# EasyEDA Pro project ProDoc_Board3_2025-07-21.epro

# Schematic Schematic1_1

## Sheets
1 POWER: Board Name: Board3; Create Date: 2025-07-19; Page Name: POWER; Project Name: 25电赛; Schematic Name: Schematic1_1; Update Date: 2025-07-19; Company: 嘉立创EDA; Page Size: A4; Version: V1.0
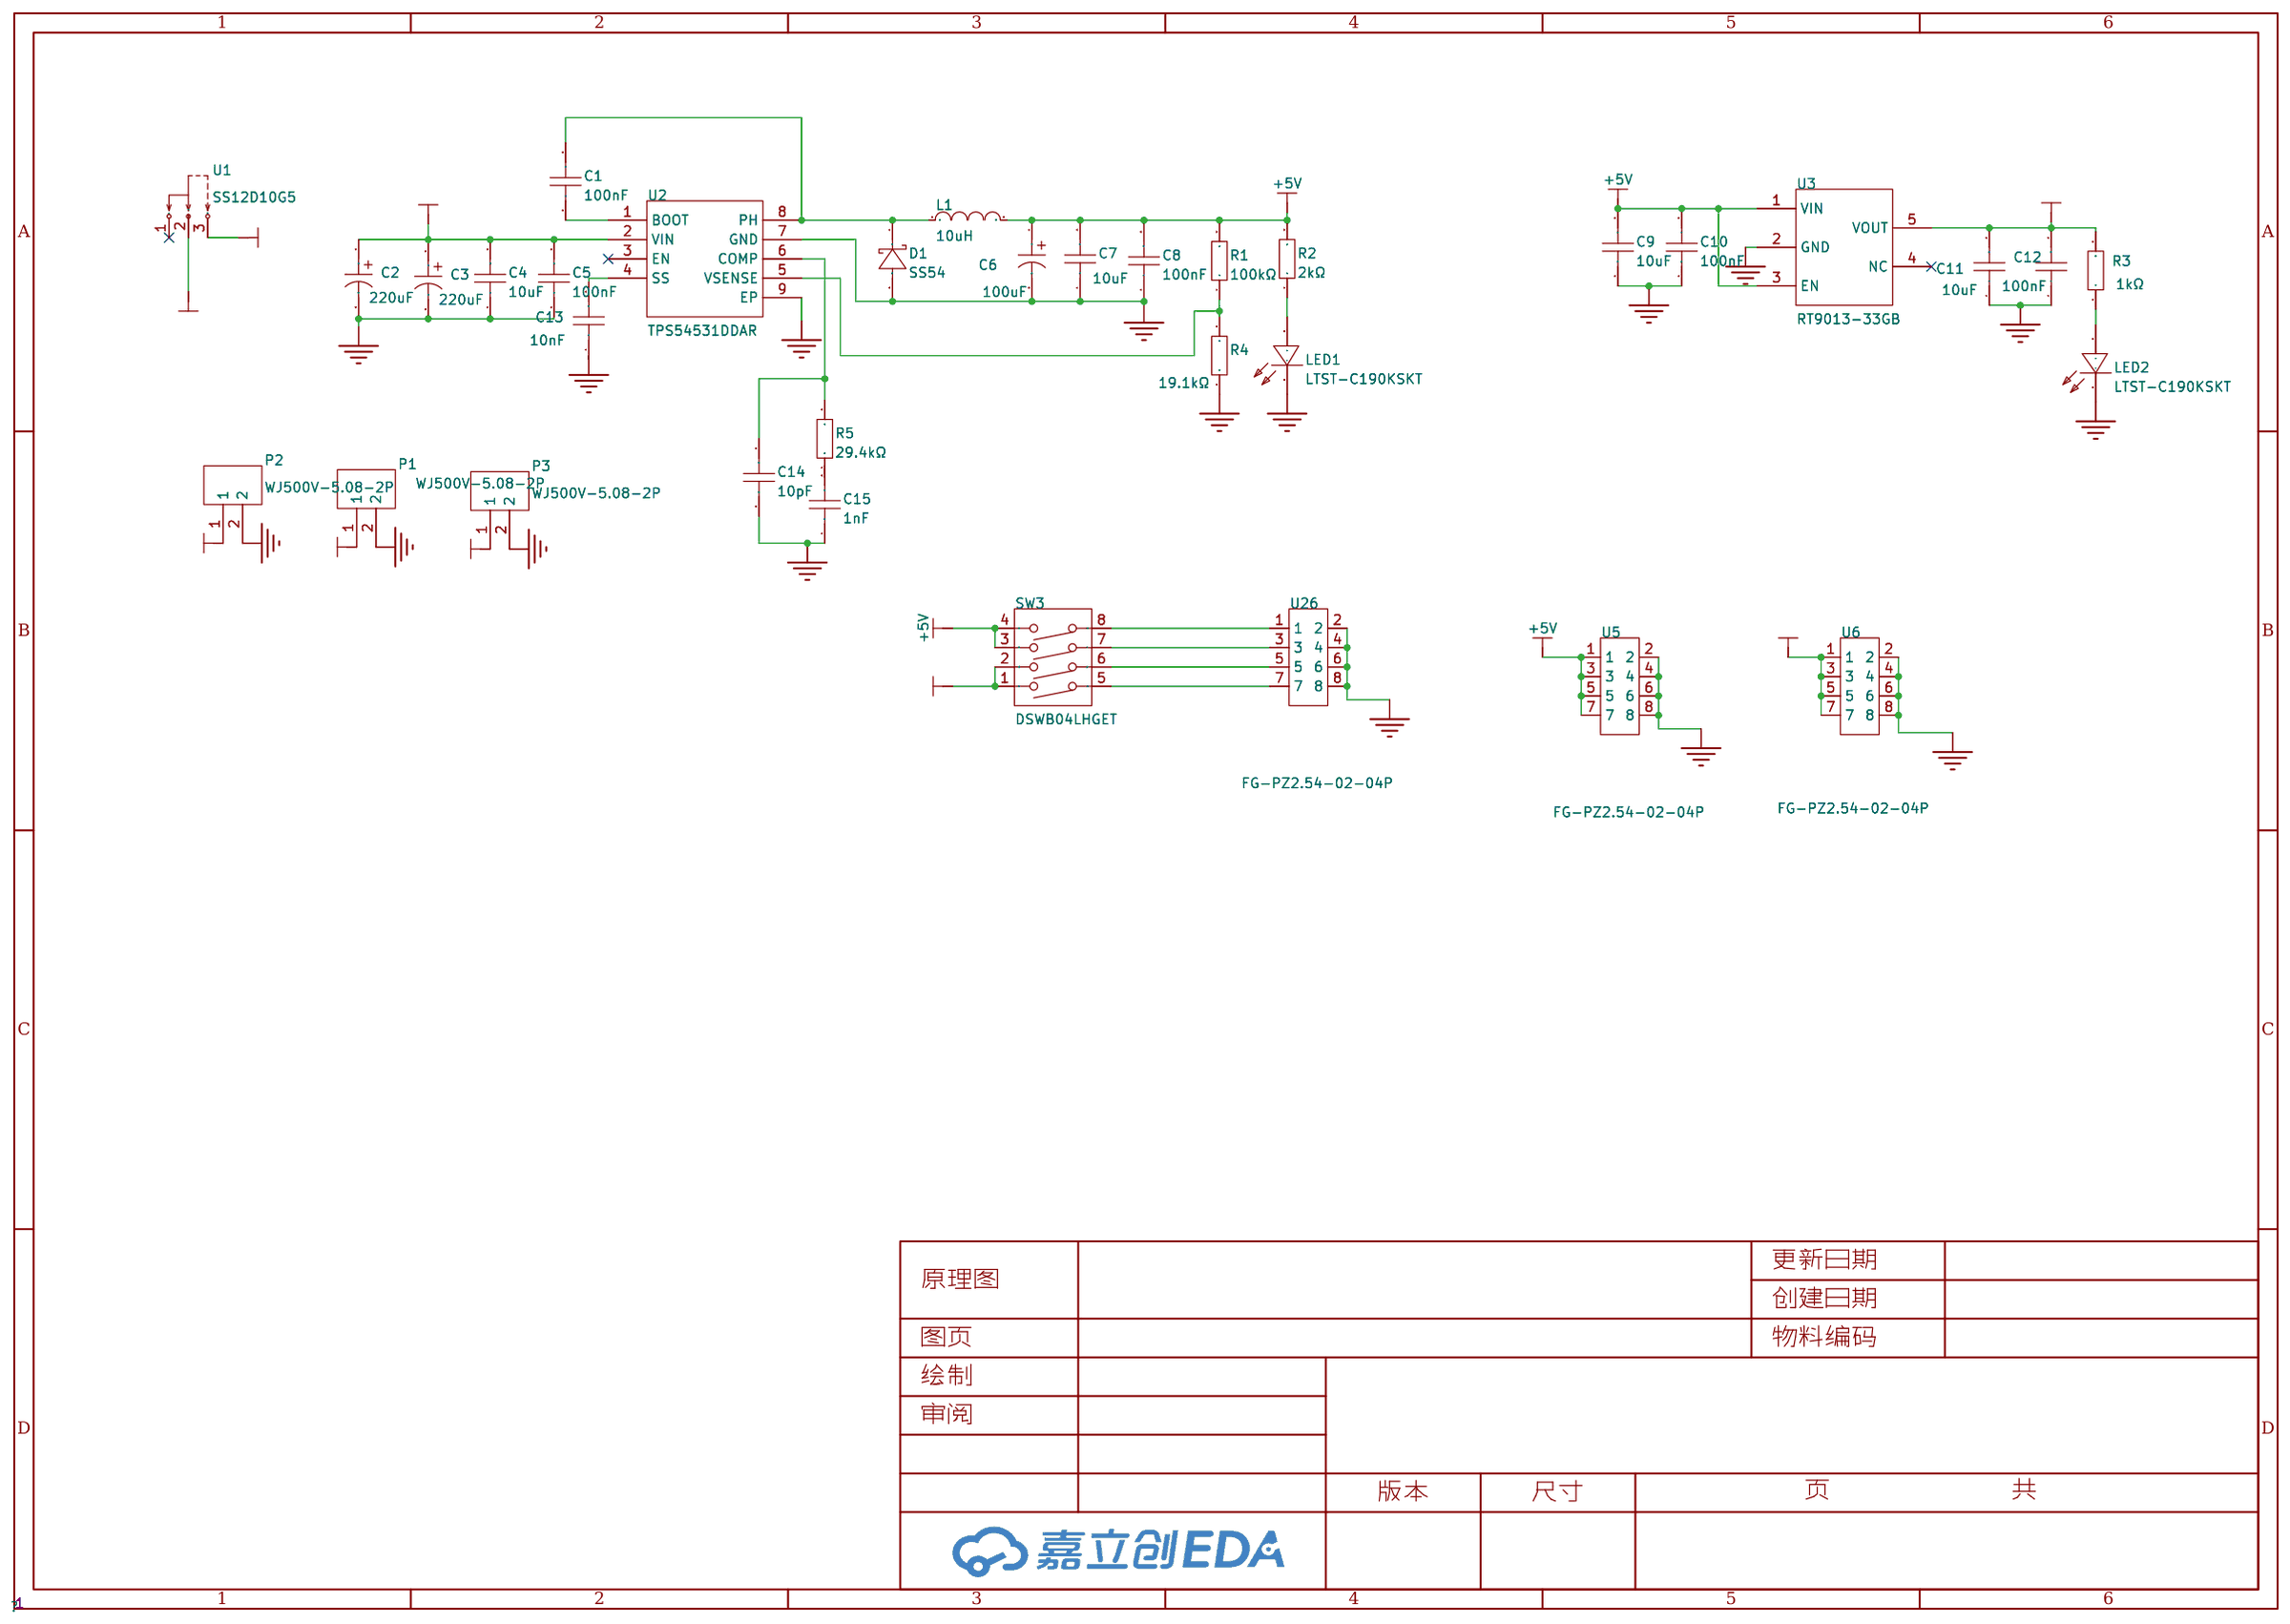
[diagram p0: POWER]
2 器件: Page Name: 器件; Update Date: 2025-07-20
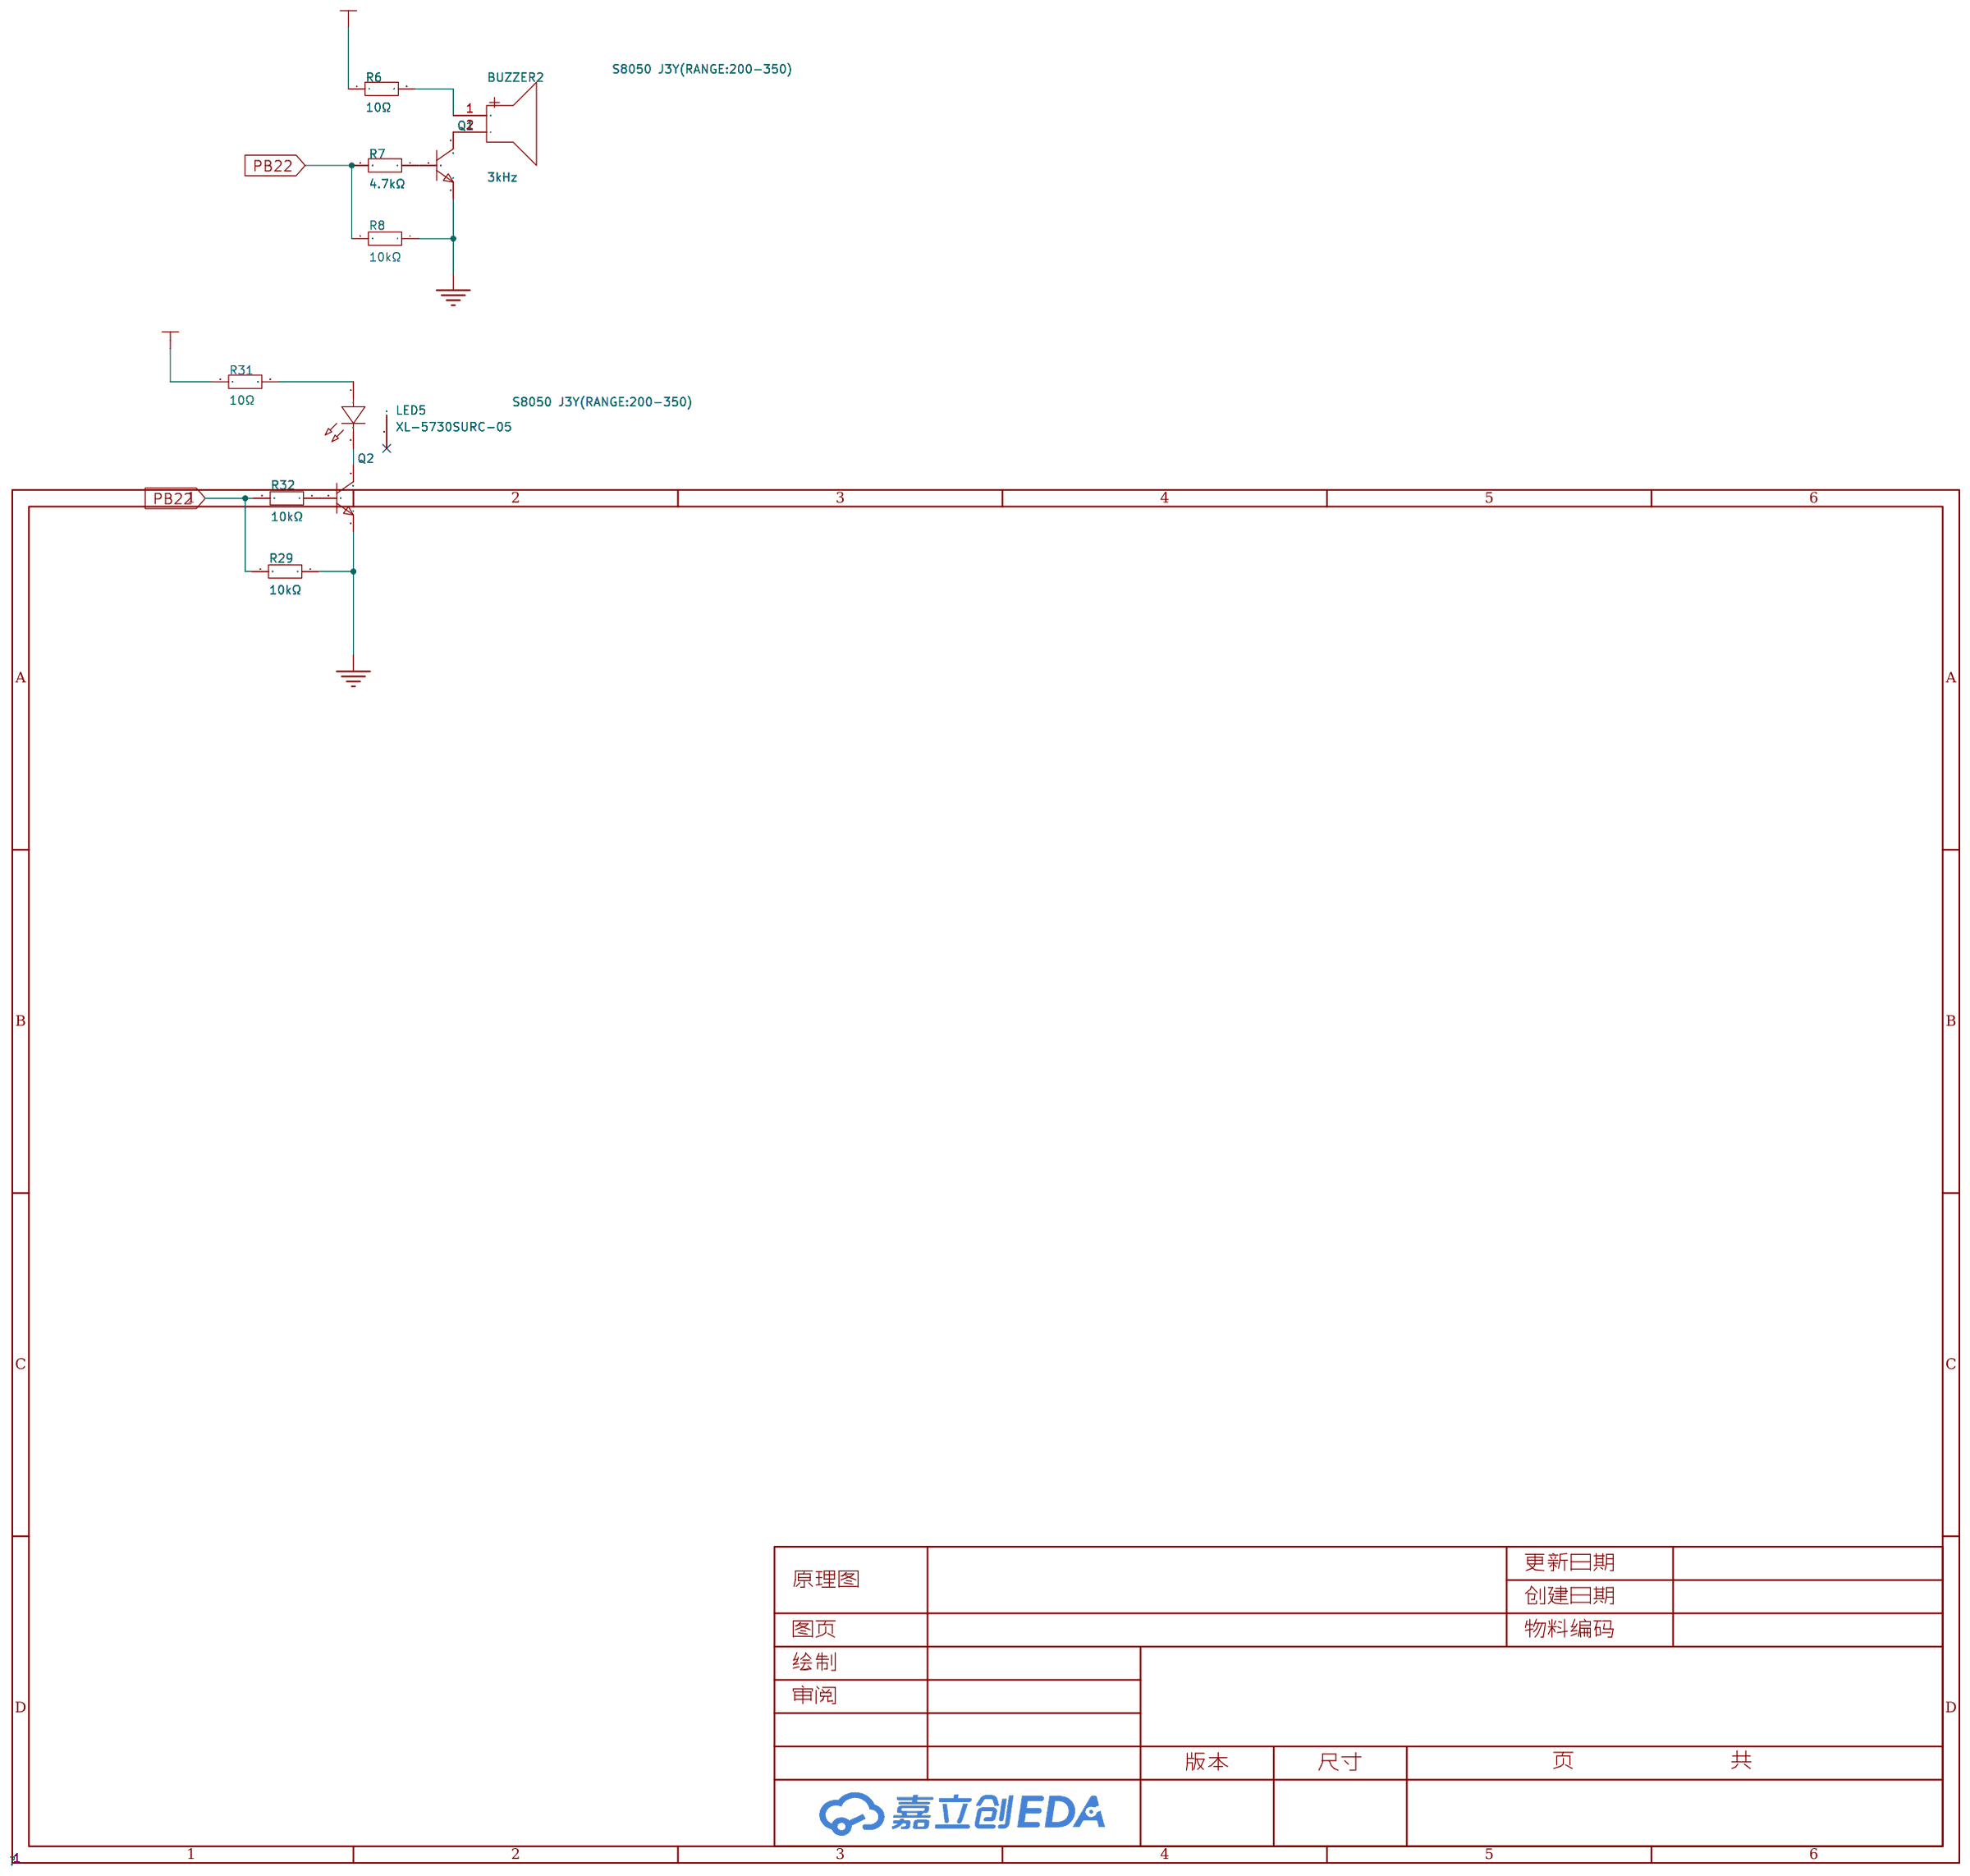
[diagram p1: 器件]
3 连接: Page Name: 连接
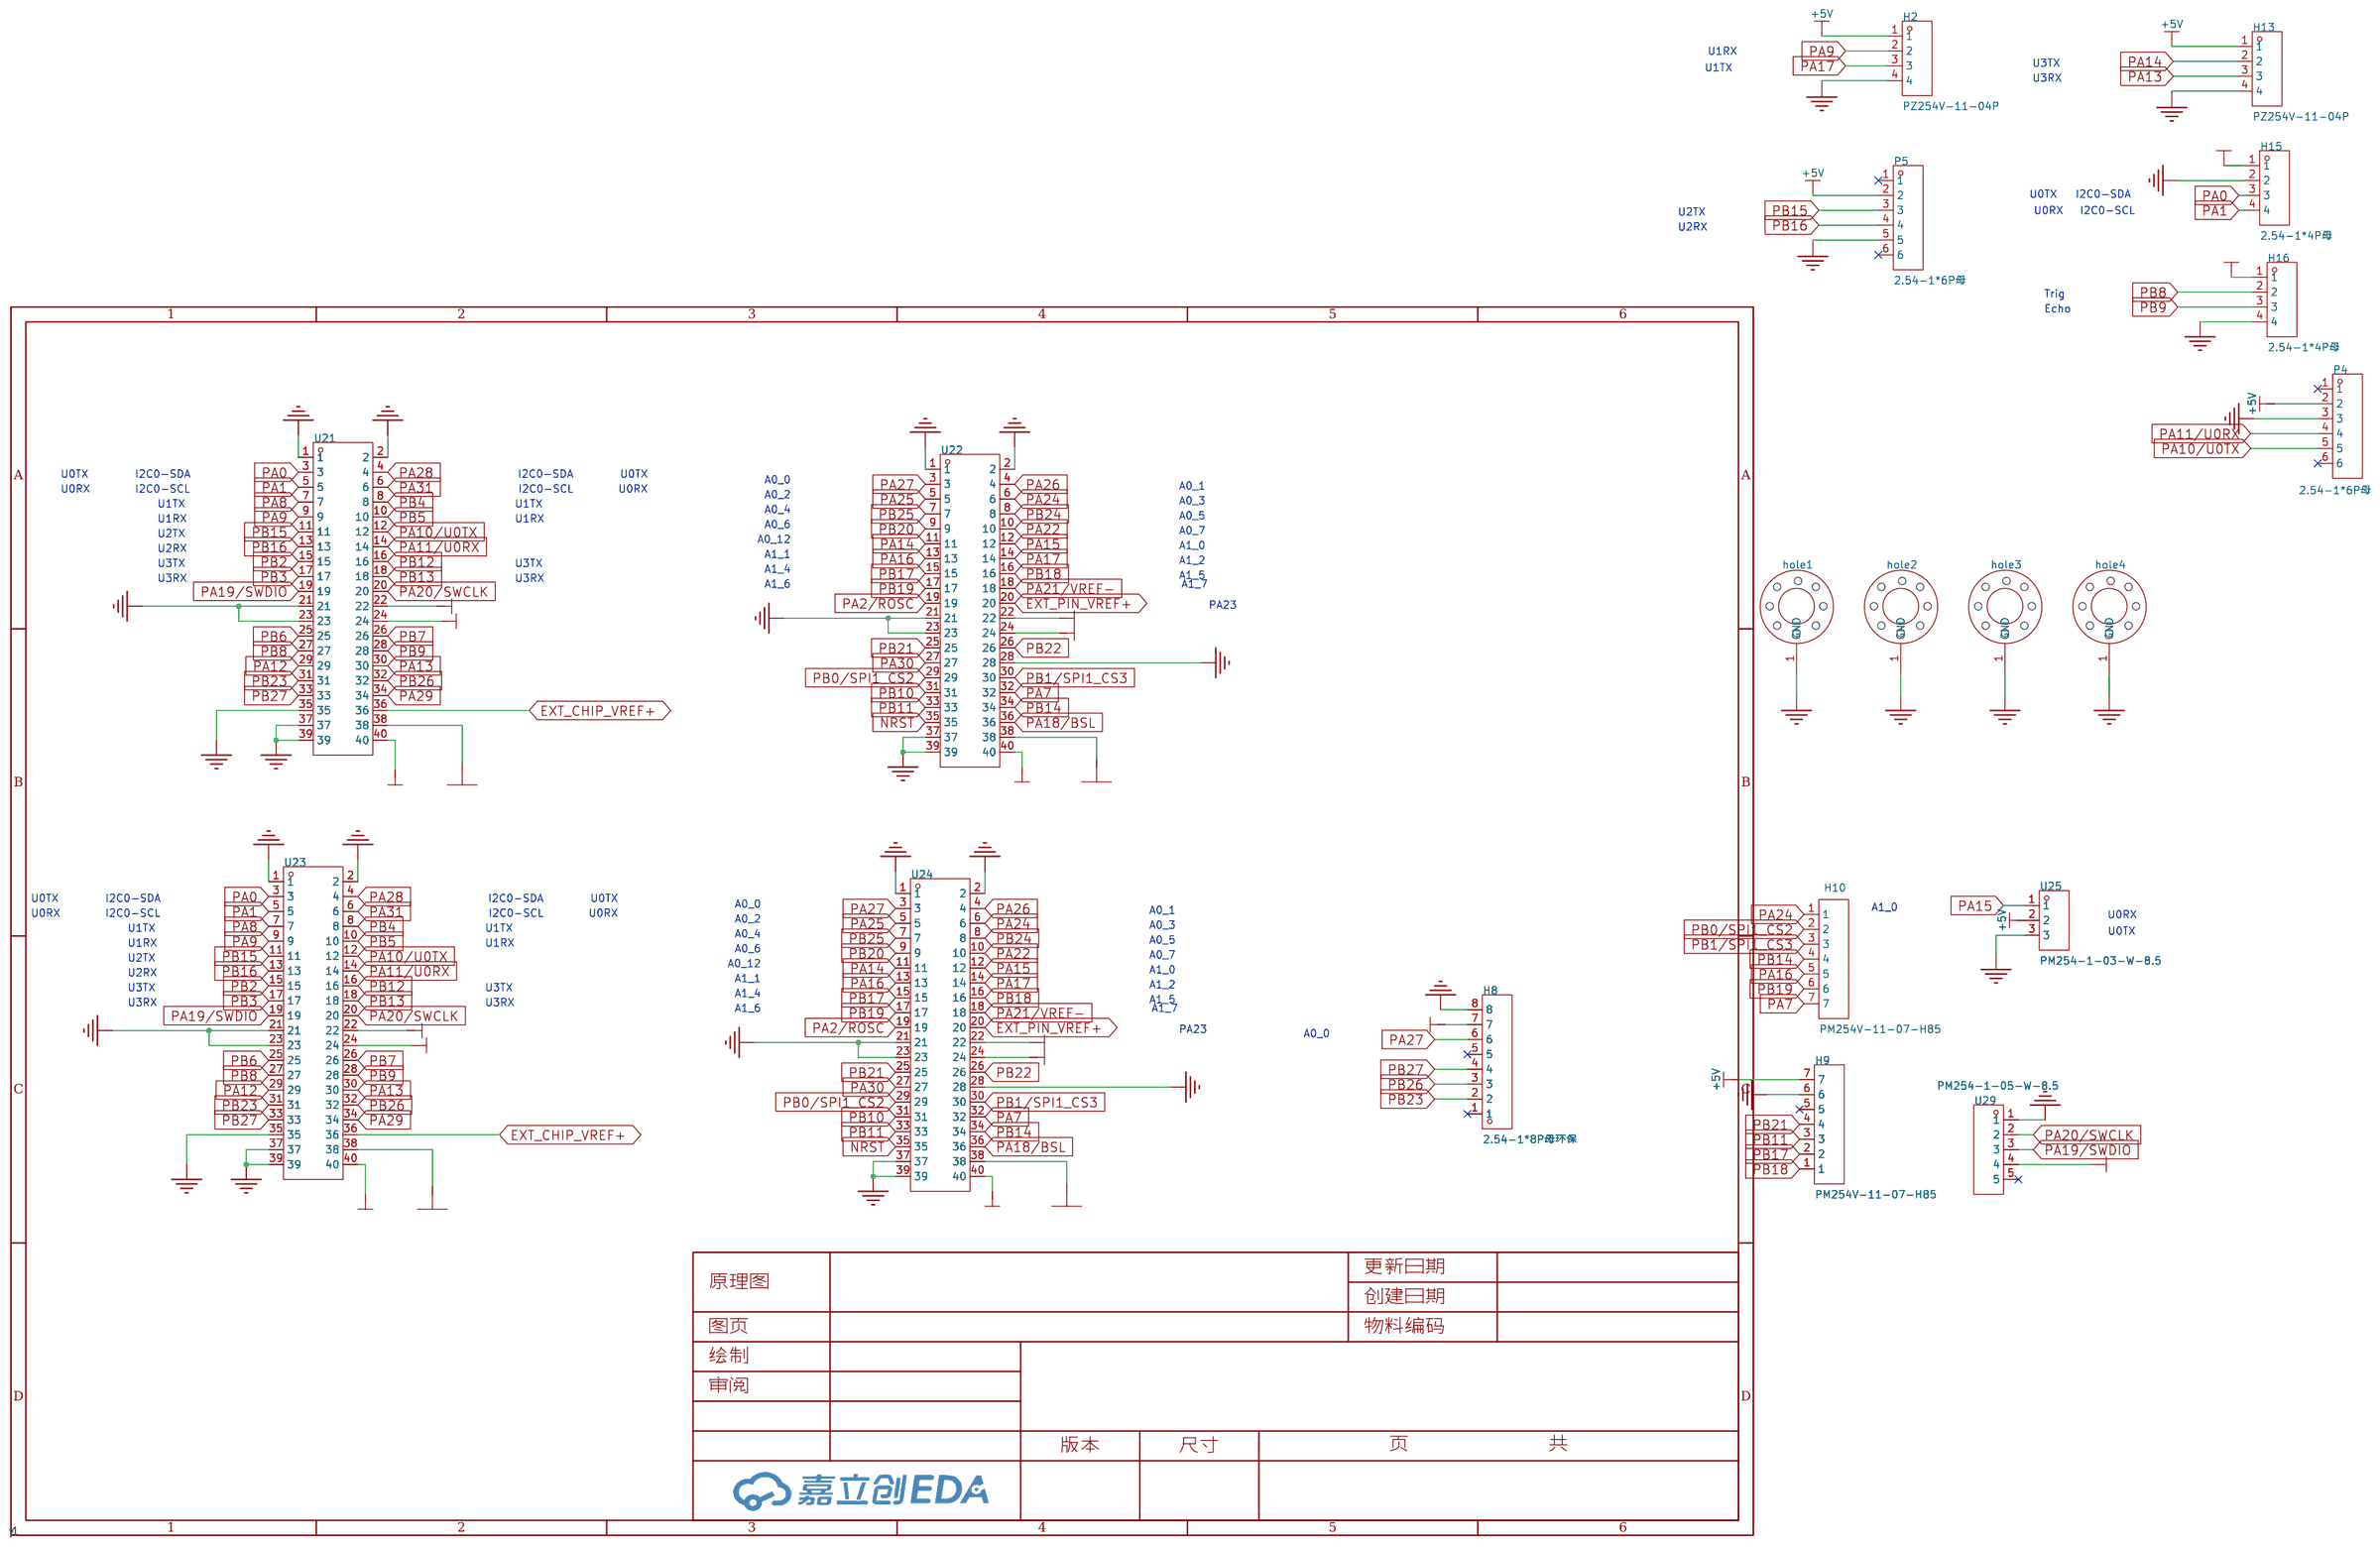
[diagram p2: 连接]

## Parts
sheet POWER
C1  100nF  [C0603]
C2  220uF  [CAP-SMD_BD6.3-L6.6-W6.6-LS7.4-FD]
C3  220uF  [CAP-SMD_BD6.3-L6.6-W6.6-LS7.4-FD]
C4  10uF  [C0805]
C5  100nF  [C0603]
C6  100uF  [CAP-SMD_BD6.3-L6.6-W6.6-LS7.6-RD]
C7  10uF  [C0805]
C8  100nF  [C0603]
C9  10uF  [C0805]
C10  100nF  [C0603]
C11  10uF  [C0805]
C12  100nF  [C0603]
C13  10nF  [C0603]
C14  10pF  [C0603]
C15  1nF  [C0603]
D1  SS54  [SMA_L4.3-W2.6-LS5.0-RD]
L1  10uH  [IND-SMD_L7.3-W6.6]
LED1  LTST-C190KSKT  [LED0603-RD]
LED2  LTST-C190KSKT  [LED0603-RD]
P1  WJ500V-5.08-2P  [CONN-TH_2P-P5.00_WJ500V-5.08-2P]
P2  WJ500V-5.08-2P  [CONN-TH_2P-P5.00_WJ500V-5.08-2P]
P3  WJ500V-5.08-2P  [CONN-TH_2P-P5.00_WJ500V-5.08-2P]
R1  100kΩ  [R0603]
R2  2kΩ  [R0603]
R3  1kΩ  [R0603]
R4  19.1kΩ  [R0603]
R5  29.4kΩ  [R0603]
SW3  DSWB04LHGET  [SW-TH_DSWB04LHGET]
U1  SS12D10G5  [SW-TH_SHOU-HAN_SS12D10G4]
U2  TPS54531DDAR  [SOIC-8_L5.0-W4.0-P1.27-LS6.0-BL-EP2.0]
U3  RT9013-33GB  [SOT-23-5_L3.0-W1.7-P0.95-LS2.8-BL]
U5  FG-PZ2.54-02-04P  [HDR-TH_8P-P2.54-V-M-R2-C4-S2.54]
U6  FG-PZ2.54-02-04P  [HDR-TH_8P-P2.54-V-M-R2-C4-S2.54]
U26  FG-PZ2.54-02-04P  [HDR-TH_8P-P2.54-V-M-R2-C4-S2.54]
sheet 器件
BUZZER2  3kHz  [BUZ-TH_BD9.0-P5.00-D0.6-FD]
LED5  XL-5730SURC-05  [LED-SMD_XL-5730SURC-05]
Q1  S8050 J3Y(RANGE:200-350)  [SOT-23-3_L3.0-W1.7-P0.95-LS2.9-BR]
Q2  S8050 J3Y(RANGE:200-350)  [SOT-23-3_L3.0-W1.7-P0.95-LS2.9-BR]
R6  10Ω  [R0603]
R7  4.7kΩ  [R0603]
R8  10kΩ  [R0603]
R29  10kΩ  [R0603]
R31  10Ω  [R0603]
R32  10kΩ  [R0603]
sheet 连接
H2  PZ254V-11-04P  [HDR-TH_4P-P2.54-V-M]
H8  2.54-1*8P母环保  [HDR-TH_8P-P2.54-V-F-1]
H9  PM254V-11-07-H85  [HDR-TH_7P-P2.54-V-F]
H10  PM254V-11-07-H85  [HDR-TH_7P-P2.54-V-F]
H13  PZ254V-11-04P  [HDR-TH_4P-P2.54-V-M]
H15  2.54-1*4P母  [HDR-TH_4P-P2.54-V-F]
H16  2.54-1*4P母  [HDR-TH_4P-P2.54-V-F]
hole1  M3  [m3 125x300]
hole2  M3  [m3 125x300]
hole3  M3  [m3 125x300]
hole4  M3  [m3 125x300]
P4  2.54-1*6P母  [HDR-TH_6P-P2.54-V-F]
P5  2.54-1*6P母  [HDR-TH_6P-P2.54-V-F]
U21  2.54-2*20  [HDR-TH_40P-P2.54-V-F-R2-C20-S2.54]
U22  2.54-2*20  [HDR-TH_40P-P2.54-V-F-R2-C20-S2.54]
U23  PZ2.54-2*20  [HDR-TH_40P-P2.54-V-M-R2-C20-S2.54]
U24  PZ2.54-2*20  [HDR-TH_40P-P2.54-V-M-R2-C20-S2.54]
U25  PM254-1-03-W-8.5  [HDR-TH_3P-P2.54-H-F-W10.0-N]
U29  PM254-1-05-W-8.5  [HDR-TH_5P-P2.54-H-F-W10.0-N]

## Library data of the parts
C1 C5 C8 C10 C12 = CC0603KRX7R9BB104: 容值:100nF;精度:±10%;额定电压:50V;温度系数:X7R;; LCSC Part Name: 100nF ±10% 50V; Supplier Part: C14663; Manufacturer: YAGEO(国巨); Supplier Footprint: 0603; JLCPCB Part Class: Basic Part; Datasheet: https://atta.szlcsc.com/upload/public/pdf/source/20180910/C282072_33301C7F631E79921B82A8DAC6BCC5B3.pdf; Supplier: LCSC; Tolerance: ±10%; Voltage Rating: 50V; Temperature Coefficient: X7R; Check: true
C2 C3 = RVT1E221M0607: 容值:220uF;精度:±20%;额定电压:25V;纹波电流:150mA@120Hz;等效串联电阻(ESR):-;; LCSC Part Name: 220uF ±20% 25V; Supplier Part: C2918361; Manufacturer: ROQANG(容强); Supplier Footprint: SMD,D6.3xL7.7mm; JLCPCB Part Class: 扩展库; Datasheet: https://atta.szlcsc.com/upload/public/pdf/source/20241024/87413EF5140CF44BEEEC408A2EAB4036.pdf; Supplier: LCSC; Tolerance: ±20%; Voltage Rating: 25V; Ripple Current: 150mA@120Hz; Diameter: 6.3mm; Height - Seated (Max): 7.7mm; Lifetime: 2000hrs@105℃; Operating Temperature: -40℃~+105℃; Check: true
C4 C7 C9 C11 = CL21A106KAYNNNE_C15850: 容值:10uF;精度:±10%;额定电压:25V;材质(温度系数):X5R;; LCSC Part Name: 10uF ±10% 25V; Supplier Part: C15850; Manufacturer: SAMSUNG(三星); Manufacturer Part: CL21A106KAYNNNE; Supplier Footprint: 0805; JLCPCB Part Class: Basic Part; Datasheet: https://atta.szlcsc.com/upload/public/pdf/source/20160218/1457707763339.pdf; Supplier: LCSC; Tolerance: ±10%; Voltage Rated: 25V; Temperature Coefficient: X5R; Check: true
C6 = RVT1H101M0607: 容值:100uF;精度:±20%;额定电压:50V;纹波电流:229mA@120Hz;; LCSC Part Name: 100uF ±20% 50V; Supplier Part: C3151829; Manufacturer: ROQANG(容强); Supplier Footprint: SMD,D6.3xL7.7mm; JLCPCB Part Class: Extended Part; Datasheet: https://atta.szlcsc.com/upload/public/pdf/source/20170325/1490427950282.pdf; Supplier: LCSC; Tolerance: ±20%; Voltage Rating: 50V; Ripple Current: 229mA@120Hz; Diameter: 6.3mm; Height - Seated (Max): 7.7mm; Lifetime: 2000hrs@105℃; Operating Temperature: -40℃~+105℃
C13 = 0603B103K500NT: 容值:10nF;精度:±10%;额定电压:50V;温度系数:X7R;; LCSC Part Name: 10nF ±10% 50V; Supplier Part: C57112; Manufacturer: FH(风华); Supplier Footprint: 0603; JLCPCB Part Class: Basic Part; Datasheet: https://atta.szlcsc.com/upload/public/pdf/source/20200305/C486355_26A10D38EF8C2A5C37091D0039909270.pdf; Supplier: LCSC; Tolerance: ±10%; Voltage Rating: 50V; Temperature Coefficient: X7R
C14 = CL10C100JB8NNNC: 容值:10pF;精度:±5%;额定电压:50V;材质(温度系数):C0G;; LCSC Part Name: 10pF ±5% 50V; Supplier Part: C1634; Manufacturer: SAMSUNG(三星); Supplier Footprint: 0603; JLCPCB Part Class: Basic Part; Datasheet: https://atta.szlcsc.com/upload/public/pdf/source/20160218/1457707763339.pdf; Supplier: LCSC; Tolerance: ±5%; Voltage Rated: 50V; Temperature Coefficient: C0G
C15 = CL10B102KB8NNNC: 容值:1nF;精度:±10%;额定电压:50V;材质(温度系数):X7R;; LCSC Part Name: 1nF ±10% 50V; Supplier Part: C1588; Manufacturer: SAMSUNG(三星); Supplier Footprint: 0603; JLCPCB Part Class: Basic Part; Datasheet: https://atta.szlcsc.com/upload/public/pdf/source/20160218/1457707763339.pdf; Supplier: LCSC; Tolerance: ±10%; Voltage Rated: 50V; Temperature Coefficient: X7R
D1 = SS54_C727065: 二极管配置:独立式;正向压降(Vf):550mV@5A;直流反向耐压(Vr):40V;整流电流:5A;; LCSC Part Name: 电压:40V 电流:5A; Supplier Part: C727065; Manufacturer: TWGMC(台湾迪嘉); Supplier Footprint: SMA(DO-214AC); JLCPCB Part Class: 扩展库; Datasheet: https://atta.szlcsc.com/upload/public/pdf/source/20200828/C727064_BD0A2B36CBC76CEA4B6710C57718D41F.pdf; Supplier: LCSC; Diode Configuration: 独立式; Forward Voltage (Vf@If): 550mV@5A; Reverse Voltage (Vr): 40V; Rectified Current: 5A; Reverse Leakage Current (Ir): 500uA; Check: true
L1 = SMMS0630-100M: 电感值:10uH;精度:±20%;额定电流:-;饱和电流(Isat):5.5A;类型:一体成型电感;; LCSC Part Name: 10uH ±20% 5.5A; Supplier Part: C128692; Manufacturer: SXN(顺翔诺); Supplier Footprint: SMD,6.6x7.3mm; JLCPCB Part Class: 扩展库; Datasheet: https://atta.szlcsc.com/upload/public/pdf/source/20210810/BBF24330FB2F5029F637830BA9C42C0D.pdf; Supplier: LCSC; Tolerance: ±20%; Saturation Current (Isat): 5.5A; DC Resistance (DCR): 68mΩ; Type: 一体成型电感; Check: true
LED1 LED2 = LTST-C190KSKT: 发光颜色:黄色;正向电压(VF):2.1V;功率:75mW;正向电流:20mA;主波长:584.5nm~597nm;二极管配置:-;透镜颜色:无色透明透镜;色温:-;发光强度:104mcd;发光角度:130°;载带方式:-;工作温度:-30℃~+85℃;; LCSC Part Name: 黄灯; Supplier Part: C125095; Manufacturer: LITEON(光宝); Supplier Footprint: 0603; JLCPCB Part Class: 扩展库; Datasheet: https://atta.szlcsc.com/upload/public/pdf/source/20180129/C125095_15171881843821315881.pdf; Supplier: LCSC; Emitted Color: 黄色; Forward Voltage (VF): 2.1V; Power Dissipation: 75mW; Forward Current: 20mA; Dominant Wavelength: 584.5nm~597nm; Peak Wavelength: 588nm; Lens Color: 无色透明透镜; Luminous Intensity: 104mcd; Viewing Angle: 130°; Operating Temperature: -30℃~+85℃; Check: true
P1-P3 = WJ500V-5.08-2P: 结构:1x2P;间距:5.08mm;颜色:绿色;安装方式:直插;额定电流:18A;额定电压:250V;排数:1;线规 - AWG:14~30;线规 - 平方毫米:2.5;每排PIN数:2;触头材质:-;触头镀层:-;工作温度范围:-40℃~+105℃;焊接温度(最大值):-;; LCSC Part Name: 1x2P 5.08mm 直插 排数:1 每排P数:2; Supplier Part: C8465; Manufacturer: KANGNEX(康奈克斯电气); Supplier Footprint: 插件,P=5.08mm; JLCPCB Part Class: 扩展库; Datasheet: https://atta.szlcsc.com/upload/public/pdf/source/20191225/C8465_02D34CE5B5B4A53DF5891601D97FA9F4.pdf; Supplier: LCSC; Structure: 1x2P; Pitch: 5.08mm; Color: 绿色; Mounting Style: 直插; Current Rating (Max): 18A; Voltage Rating (Max): 250V; Number of Pins: 2P; Number of Rows: 1; Wire Gauge - AWG: 14~30; Wire Gauge - mm2: 2.5; Number of PINs Per Row: 2; Operating Temperature Range: -40℃~+105℃; Screw Specification: M2.5; Check: true
R1 = 0603WAF1003T5E: 电阻类型:厚膜电阻;阻值:100kΩ;精度:±1%;功率:100mW;最大工作电压:75V;温度系数:±100ppm/℃;; LCSC Part Name: 100kΩ ±1% 100mW 厚膜电阻; Supplier Part: C25803; Manufacturer: UNI-ROYAL(厚声); Supplier Footprint: 0603; JLCPCB Part Class: Basic Part; Datasheet: https://atta.szlcsc.com/upload/public/pdf/source/20200306/C422600_1E6D84923E4A46A82E41ADD87F860B5C.pdf; Supplier: LCSC; Type: 厚膜电阻; Tolerance: ±1%; Power(Watts): 100mW; Overload Voltage (Max): 75V; Temperature Coefficient: ±100ppm/℃; Operating Temperature Range: -55℃~+155℃
R2 = 0603WAF2001T5E: 电阻类型:厚膜电阻;阻值:2kΩ;精度:±1%;功率:100mW;最大工作电压:75V;温度系数:±100ppm/℃;; LCSC Part Name: 2kΩ ±1% 100mW 厚膜电阻; Supplier Part: C22975; Manufacturer: UNI-ROYAL(厚声); Supplier Footprint: 0603; JLCPCB Part Class: Basic Part; Datasheet: https://atta.szlcsc.com/upload/public/pdf/source/20200306/C422600_1E6D84923E4A46A82E41ADD87F860B5C.pdf; Supplier: LCSC; Type: 厚膜电阻; Tolerance: ±1%; Power(Watts): 100mW; Overload Voltage (Max): 75V; Temperature Coefficient: ±100ppm/℃; Operating Temperature Range: -55℃~+155℃
R3 = 0603WAF1001T5E: 电阻类型:厚膜电阻;阻值:1kΩ;精度:±1%;功率:100mW;最大工作电压:75V;温度系数:±100ppm/℃;; LCSC Part Name: 1kΩ ±1% 100mW 厚膜电阻; Supplier Part: C21190; Manufacturer: UNI-ROYAL(厚声); Supplier Footprint: 0603; JLCPCB Part Class: Basic Part; Datasheet: https://atta.szlcsc.com/upload/public/pdf/source/20200306/C422600_1E6D84923E4A46A82E41ADD87F860B5C.pdf; Supplier: LCSC; Type: 厚膜电阻; Tolerance: ±1%; Power(Watts): 100mW; Overload Voltage (Max): 75V; Temperature Coefficient: ±100ppm/℃; Operating Temperature Range: -55℃~+155℃
R4 = 0603WAF1912T5E: 电阻类型:厚膜电阻;阻值:19.1kΩ;精度:±1%;功率:100mW;最大工作电压:75V;温度系数:±100ppm/℃;; LCSC Part Name: 19.1kΩ ±1% 100mW 厚膜电阻; Supplier Part: C22897; Manufacturer: UNI-ROYAL(厚声); Supplier Footprint: 0603; JLCPCB Part Class: Extended Part; Datasheet: https://atta.szlcsc.com/upload/public/pdf/source/20200306/C422600_1E6D84923E4A46A82E41ADD87F860B5C.pdf; Supplier: LCSC; Type: 厚膜电阻; Tolerance: ±1%; Power(Watts): 100mW; Overload Voltage (Max): 75V; Temperature Coefficient: ±100ppm/℃; Operating Temperature Range: -55℃~+155℃
R5 = FRC0603F2942TS: 电阻类型:厚膜电阻;阻值:29.4kΩ;精度:±1%;功率:100mW;工作电压:75V;温度系数:±100ppm/℃;; LCSC Part Name: 29.4kΩ ±1% 100mW 厚膜电阻; Supplier Part: C2930086; Manufacturer: FOJAN(富捷); Supplier Footprint: 0603; JLCPCB Part Class: Extended Part; Datasheet: https://atta.szlcsc.com/upload/public/pdf/source/20211221/925EC7D7225764EE0046F22065062C87.pdf; Supplier: LCSC; Type: 厚膜电阻; Tolerance: ±1%; Power(Watts): 100mW; Voltage-Supply(Max): 75V; Temperature Coefficient: ±100ppm/℃; Operating Temperature: -55℃~+155℃
SW3 = DSWB04LHGET: 类型:平拨,凸起式;电路结构:单刀单掷;开关位数:4位;使用寿命:-;颜色:红色;; LCSC Part Name: 间距2.54mm 平拨,凸起式 4位拨码开关; Supplier Part: C99418; Manufacturer: YE; Supplier Footprint: 插件; JLCPCB Part Class: 扩展库; Datasheet: https://atta.szlcsc.com/upload/public/pdf/source/20220830/02827E67A8727938D957A3CE4C86C92D.pdf; Supplier: LCSC; Type: 平拨,凸起式; Circuit: 单刀单掷; Number of Positions: 4位; Lead Pitch: 2.54mm; Color: 红色; Check: true
U1 = SS12D10G5: 电路结构:单刀双掷;安装方式:直插;额定电流(DC):2A;额定电压(DC):125V;机械寿命:3千次;; LCSC Part Name: 两档立式插件 3脚拨动开关 柄长5.0mm; Supplier Part: C7431054; Manufacturer: SHOU HAN(首韩); Supplier Footprint: 插件; JLCPCB Part Class: 扩展库; Datasheet: https://atta.szlcsc.com/upload/public/pdf/source/20231130/7A3DB6A149BF0A1DCFFE64FFC07FE434.pdf; Supplier: LCSC; Circuit: 单刀双掷; Switch Length: 12.7mm; Switch Width: 6.7mm; Mounting Style: 直插; Current Rating (DC): 2A; Voltage Rating (DC): 125V; Mechanical Life: 3千次; Operating Temperature: -25℃~+70℃; Check: true
U2 = TPS54531DDAR: 功能类型:降压型;输出类型:可调;工作电压:3.5V~28V;输出电压:-;输出电流:5A;; LCSC Part Name: 28V输入非同步降压转换器; Supplier Part: C50605; Manufacturer: TI(德州仪器); Supplier Footprint: SOIC-8-EP; JLCPCB Part Class: 扩展库; Datasheet: https://www.ti.com/cn/lit/gpn/tps54531; Supplier: LCSC; Function: 降压型; Output Type: 可调; Input Voltage: 3.5V~28V; Output Current: 5A; Switching Frequency: 570kHz; Operating Temperature: -40℃~+150℃; Synchronous Rectification: 否; Number of Outputs: 1; Topology: 降压式; Switch tube (built-in/external): 内置; Check: true
U3 = RT9013-33GB: 输出类型:固定;最大输入电压:5.5V;输出电压:3.3V;输出电流:500mA;电源纹波抑制比(PSRR):50dB@(10kHz);输出极性:正极;; LCSC Part Name: 输入5.5V 输出3.3V 500mA; Supplier Part: C47773; Manufacturer: RICHTEK(立锜); Supplier Footprint: SOT-23-5; JLCPCB Part Class: 扩展库; Datasheet: https://atta.szlcsc.com/upload/public/pdf/source/20150504/1457707282459.pdf; Supplier: LCSC; Output Type: 固定; Maximum Input Voltage: 5.5V; Output Voltage: 3.3V; Output Current: 500mA; Power Supply Rejection Ratio (PSRR): 50dB@(10kHz); Dropout Voltage: 400mV@(500mA); standby current: 50uA; Feature: 低ESR；防静电保护；热保护(TSD)；过流保护(OCP)；带使能; Operating Temperature: -40℃~+85℃; Output Polarity: 正极; Number of Outputs: 1; Check: true
U5 U6 U26 = FG-PZ2.54-02-04P: 插针结构:2x4P;间距:2.54mm;圆针/方针:方针;排数:双排;; LCSC Part Name: 2x4P 间距:2.54mm 方针; Supplier Part: C25687208; Manufacturer: FG(富港); Supplier Footprint: 插件,P=2.54mm; JLCPCB Part Class: 扩展库; Datasheet: https://atta.szlcsc.com/upload/public/pdf/source/20240704/F8AB094A27FC1A2223B0A3F69FCFEA68.pdf; Supplier: LCSC; Pin Structure: 2x4P; Pitch: 2.54mm; Circluar Pins/Square Pins: 方针; Number of Rows: 双排; Check: true
BUZZER2 = HNB09A03: 驱动方式:有源(内含驱动线路);构造类型:电磁式;频率:3kHz;声压(SPL):85dB;; LCSC Part Name: 电磁式有源一体蜂鸣器HNB09A03; Supplier Part: C96102; Manufacturer: 华能; Supplier Footprint: 插件,D=9mm; JLCPCB Part Class: Extended Part; Datasheet: https://atta.szlcsc.com/upload/public/pdf/source/20241128/61C4C8C3938BB25F7C38FBE94CCE8DCF.pdf; Supplier: LCSC; Driver Circuitry: 有源(内含驱动线路); Technology: 电磁式; Voltage - Supply: 1.5V~4.5V; Current Consumption: 30mA; Sound Pressure Level(SPL): 85dB; Diameter(φD): 9mm; Height: 5.5mm; Operating Temperature: -20℃~+70℃
LED5 = XL-5730SURC-05: 发光颜色:红色;正向电压(VF):2.4V;功率:500mW;正向电流:150mA;主波长:620nm~630nm;透镜颜色:无色透明透镜;色温:-;发光角度:120°;载带方式:正贴;工作温度:-20℃~+80℃;; Supplier Part: C2843883; Manufacturer: XINGLIGHT(成兴光); Supplier Footprint: SMD5730; JLCPCB Part Class: 扩展库; Datasheet: https://atta.szlcsc.com/upload/public/pdf/source/20240218/310FB6094B868C78581956B82D4B60CF.pdf; Supplier: LCSC; Emitted Color: 红色; Forward Voltage (VF): 2.4V; Power Dissipation: 500mW; Forward Current: 150mA; Dominant Wavelength: 620nm~630nm; Peak Wavelength: 625nm; Lens Color: 无色透明透镜; Viewing Angle: 120°; Mounting Sytle: 正贴; Operating Temperature: -20℃~+80℃
Q1 Q2 = S8050 J3Y(RANGE:200-350): 晶体管类型:NPN;集电极电流(Ic):500mA;集射极击穿电压(Vceo):25V;耗散功率(Pd):300mW;直流电流增益(hFE):200@500mA,1V;; LCSC Part Name: H档(200-350); Supplier Part: C2146; Manufacturer: CJ(江苏长电/长晶); Supplier Footprint: SOT-23; JLCPCB Part Class: 基础库; Datasheet: https://atta.szlcsc.com/upload/public/pdf/source/20231013/FF37B6A000E6CDA75C9C999D2E78731F.pdf; Supplier: LCSC; type: NPN; Current - Collector(Ic): 500mA; Collector - Emitter Voltage VCEO: 25V; Pd - Power Dissipation: 300mW; DC Current Gain: 200@500mA,1V; Transition frequency(fT): 150MHz; Current - Collector Cutoff: 100nA; Vce Saturation(VCE(sat)): 600mV; Operating Temperature: -55℃~+150℃; Check: true
R6 R31 = 0603WAF100JT5E: 电阻类型:厚膜电阻;阻值:10Ω;精度:±1%;功率:100mW;最大工作电压:75V;温度系数:±400ppm/℃;; LCSC Part Name: 10Ω ±1% 100mW 厚膜电阻; Supplier Part: C22859; Manufacturer: UNI-ROYAL(厚声); Supplier Footprint: 0603; JLCPCB Part Class: Basic Part; Datasheet: https://atta.szlcsc.com/upload/public/pdf/source/20200306/C422600_1E6D84923E4A46A82E41ADD87F860B5C.pdf; Supplier: LCSC; Type: 厚膜电阻; Tolerance: ±1%; Power(Watts): 100mW; Overload Voltage (Max): 75V; Temperature Coefficient: ±400ppm/℃; Operating Temperature Range: -55℃~+155℃
R7 = 0603WAF4701T5E: 电阻类型:厚膜电阻;阻值:4.7kΩ;精度:±1%;功率:100mW;最大工作电压:75V;温度系数:±100ppm/℃;; LCSC Part Name: 4.7kΩ ±1% 100mW 厚膜电阻; Supplier Part: C23162; Manufacturer: UNI-ROYAL(厚声); Supplier Footprint: 0603; JLCPCB Part Class: 基础库; Datasheet: https://atta.szlcsc.com/upload/public/pdf/source/20200306/C422600_1E6D84923E4A46A82E41ADD87F860B5C.pdf; Supplier: LCSC; Type: 厚膜电阻; Tolerance: ±1%; Power(Watts): 100mW; Overload Voltage (Max): 75V; Temperature Coefficient: ±100ppm/℃; Operating Temperature Range: -55℃~+155℃; Check: true
R8 R29 R32 = 0603WAF1002T5E: 电阻类型:厚膜电阻;阻值:10kΩ;精度:±1%;功率:100mW;工作电压:75V;温度系数:±100ppm/℃;; LCSC Part Name: 厚膜电阻 10kΩ ±1% 100mW; Supplier Part: C25804; Manufacturer: UNI-ROYAL(厚声); Supplier Footprint: 0603; JLCPCB Part Class: Basic Part; Datasheet: https://atta.szlcsc.com/upload/public/pdf/source/20200306/C422600_1E6D84923E4A46A82E41ADD87F860B5C.pdf; Supplier: LCSC; Type: 厚膜电阻; Tolerance: ±1%; Power(Watts): 100mW; Overload Voltage (Max): 75V; Temperature Coefficient: ±100ppm/℃; Operating Temperature Range: -55℃~+155℃; Voltage-Supply(Max): 75V; Operating Temperature: -55℃~+155℃
H2 H13 = PZ254V-11-04P: 插针结构:1x4P;间距:2.54mm;行距:-;圆针/方针:方针;安装类型:直插;排数:单排;总PIN位数:4P;额定电流:3A;额定电压:250V;配合针长度:6mm;塑高:2.5mm;端接针长度:3mm;触头材质:-;工作温度范围:-40℃~+105℃;颜色:黑色;; LCSC Part Name: 间距:2.54mm 1x4P 直插 方针; Supplier Part: C2691448; Manufacturer: XFCN(兴飞); Supplier Footprint: 插件,P=2.54mm; JLCPCB Part Class: 扩展库; Datasheet: https://atta.szlcsc.com/upload/public/pdf/source/20200309/C492403_F9F19131791D08044AD4F84F8E751A34.pdf; Supplier: LCSC; Pin Structure: 1x4P; Pitch: 2.54mm; Circluar Pins/Square Pins: 方针; Mounting Type: 直插; Number of Rows: 单排; Number of Pins: 4P; Current Rating (Max): 3A; Voltage Rating (Max): 250V; Length of Mating Pin: 6mm; Insulation Height: 2.5mm; Length of End Connection Pin: 3mm; Operating Temperature Range: -40℃~+105℃; Color: 黑色; Check: true
H8 = 2.54-1*8P母环保: 插孔结构:1x8P;间距:2.54mm;行距:-;安装类型:直插;排数:单排;总孔位数:8P;塑高:-;触头材质:-;触头镀层:-;; LCSC Part Name: 间距:2.54mm 1x8P 直插; Supplier Part: C27438; Manufacturer: BOOMELE(博穆精密); Supplier Footprint: 插件,P=2.54mm; JLCPCB Part Class: Extended Part; Datasheet: https://atta.szlcsc.com/upload/public/pdf/source/20231221/1CA800C6799ED97958773716FAA1BFFE.pdf; Supplier: LCSC; Holes Structure: 1x8P; Pitch: 2.54mm; Mounting Type: 直插; Number of Rows: 单排; Number of Holes: 8P
H9 H10 = PM254V-11-07-H85: 插孔结构:1x7P;间距:2.54mm;行距:-;圆孔/方孔:方孔;安装类型:直插;排数:单排;总孔位数:7P;额定电流:3A;额定电压:250V;插孔方向:顶部;塑高:-;工作温度范围:-40℃~+105℃;; LCSC Part Name: 间距:2.54mm 1x7P 直插; Supplier Part: C2832270; Manufacturer: XFCN(兴飞); Supplier Footprint: 插件,P=2.54mm; JLCPCB Part Class: Extended Part; Datasheet: https://atta.szlcsc.com/upload/public/pdf/source/20210514/C2832270_F424CC0071A81298BFB56B53406F9842.pdf; Supplier: LCSC; Holes Structure: 1x7P; Pitch: 2.54mm; Circular Hole / Square Hole: 方孔; Mounting Type: 直插; Number of Rows: 单排; Number of Holes: 7P; Current Rating (Max): 3A; Voltage Rating (Max): 250V; Holes Direction: 顶部; Operating Temperature Range: -40℃~+105℃
H15 H16 = 2.54-1*4P母: 插孔结构:1x4P;间距:2.54mm;行距:-;圆孔/方孔:方孔;安装类型:直插;排数:单排;总孔位数:4P;额定电流:3A;额定电压:-;插孔方向:顶部;塑高:-;触头材质:青铜;触头镀层:-;工作温度范围:-40℃~+105℃;焊接温度(最大值):-;; LCSC Part Name: 间距:2.54mm 1x4P 直插; Supplier Part: C2718488; Manufacturer: BOOMELE(博穆精密); Supplier Footprint: 插件,P=2.54mm; JLCPCB Part Class: 扩展库; Datasheet: https://atta.szlcsc.com/upload/public/pdf/source/20210301/C2718488_F4427B881E42CAA8DDB0B1C12B3A522C.pdf; Supplier: LCSC; Holes Structure: 1x4P; Pitch: 2.54mm; Circular Hole / Square Hole: 方孔; Mounting Type: 直插; Number of Rows: 单排; Number of Holes: 4P; Current Rating (Max): 3A; Holes Direction: 顶部; Contact Material: 青铜; Operating Temperature Range: -40℃~+105℃
hole1-hole4 = m3_梅花螺丝孔: 梅花螺丝孔; Check: false
P4 P5 = 2.54-1*6P母: 插孔结构:1x6P;间距:2.54mm;行距:-;安装类型:直插;排数:单排;总孔位数:6P;塑高:-;触头材质:-;触头镀层:-;; LCSC Part Name: 间距:2.54mm 1x6P 直插; Supplier Part: C40877; Manufacturer: BOOMELE(博穆精密); Supplier Footprint: 插件,P=2.54mm; JLCPCB Part Class: 扩展库; Datasheet: https://atta.szlcsc.com/upload/public/pdf/source/20210301/C2718488_F4427B881E42CAA8DDB0B1C12B3A522C.pdf; Supplier: LCSC; Holes Structure: 1x6P; Pitch: 2.54mm; Mounting Type: 直插; Number of Rows: 单排; Number of Holes: 6P
U21 U22 = 2.54-2*20: 插孔结构:2x20P;间距:2.54mm;行距:2.54mm;圆孔/方孔:方孔;安装类型:直插;排数:双排;总孔位数:40P;额定电流:2.5A;额定电压:-;插孔方向:顶部;塑高:8.5mm;工作温度范围:-40℃~+105℃;; LCSC Part Name: 间距:2.54mm 2x20P 直插; Supplier Part: C2977589; Manufacturer: ZHOURI(洲日); Supplier Footprint: 插件,P=2.54mm; JLCPCB Part Class: Extended Part; Datasheet: https://atta.szlcsc.com/upload/public/pdf/source/20220328/834E302BE3C038BBC5C70F5E02589B1E.pdf; Supplier: LCSC; Holes Structure: 2x20P; Pitch: 2.54mm; Row Spacing: 2.54mm; Circular Hole / Square Hole: 方孔; Mounting Type: 直插; Number of Rows: 双排; Number of Holes: 40P; Current Rating (Max): 2.5A; Holes Direction: 顶部; Insulation Height: 8.5mm; Operating Temperature Range: -40℃~+105℃
U23 U24 = PZ2.54-2*20: 插针结构:2x20P;间距:2.54mm;安装类型:直插;排数:双排;总PIN位数:40P;触头镀层:金;; Supplier Part: C5224014; Manufacturer: ZHOURI(洲日); Supplier Footprint: 插件,P=2.54mm; JLCPCB Part Class: 扩展库; Datasheet: https://atta.szlcsc.com/upload/public/pdf/source/20221102/7E8316C38DB6D81BB18273F4CFF8B2F6.pdf; Supplier: LCSC; Pin Structure: 2x20P; Pitch: 2.54mm; Mounting Type: 直插; Number of Rows: 双排; Number of Pins: 40P; Contact Plating: 金; Check: true
U25 = PM254-1-03-W-8.5: 插孔结构:1x3P;间距:2.54mm;行距:-;圆孔/方孔:方孔;安装类型:弯插;排数:单排;总孔位数:3P;额定电流:3A;额定电压:-;插孔方向:侧面;塑高:8.5mm;触头材质:铜合金;工作温度范围:-40℃~+105℃;焊接温度(最大值):260℃@5S;; LCSC Part Name: 1x3P 间距:2.54mm 弯插; Supplier Part: C2897385; Manufacturer: HCTL(华灿天禄); Supplier Footprint: 弯插,P=2.54mm; JLCPCB Part Class: 扩展库; Datasheet: https://atta.szlcsc.com/upload/public/pdf/source/20230609/7BA40A3D721268A082DCDEAD4C99131B.pdf; Supplier: LCSC; Holes Structure: 1x3P; Pitch: 2.54mm; Circular Hole / Square Hole: 方孔; Mounting Type: 弯插; Number of Rows: 单排; Number of Holes: 3P; Current Rating (Max): 3A; Holes Direction: 侧面; Insulation Height: 8.5mm; Contact Material: 铜合金; Operating Temperature Range: -40℃~+105℃; Soldering Temperature(Max): 260℃@5S; Check: true
U29 = PM254-1-05-W-8.5: 插孔结构:1x5P;间距:2.54mm;行距:-;圆孔/方孔:方孔;安装方式:弯插;排数:单排;总孔位数:5P;额定电流:3A;额定电压:-;插孔方向:侧面;塑高:8.5mm;触头材质:铜合金;工作温度:-40℃~+105℃;; LCSC Part Name: 1x5P 间距:2.54mm 弯插; Supplier Part: C2897387; Manufacturer: HCTL(华灿天禄); Supplier Footprint: 弯插,P=2.54mm; JLCPCB Part Class: 扩展库; Datasheet: https://atta.szlcsc.com/upload/public/pdf/source/20230609/7BA40A3D721268A082DCDEAD4C99131B.pdf; Supplier: LCSC; Holes Structure: 1x5P; Pitch: 2.54mm; Circular Hole / Square Hole: 方孔; Mounting Type: 弯插; Number of Rows: 单排; Number of Positions: 5P; Current Rating: 3A; Holes Direction: 侧面; Insulation Height: 8.5mm; Contact Material: 铜合金; Operating Temperature: -40℃~+105℃

## Nets
3V3: C11.2 C12.2 R3.2 R6.1 R31.1 SW3.1 SW3.2 U3.5(VOUT) U6.1 U6.3 U6.5 U6.7 U21.22 U21.38 U22.22 U22.38 U23.22 U23.38 U24.22 U24.38 U29.4
+5V: C6.1 C7.2 C8.2 C9.2 C10.2 H2.1 H8.7 H9.7 H13.1 H15.1 H16.1 L1.2 P4.2 P5.2 R1.2 R2.2 SW3.3 SW3.4 U3.1(VIN) U3.3(EN) U5.1 U5.3 U5.5 U5.7 U21.24 U21.40 U22.24 U22.40 U23.24 U23.40 U24.24 U24.40 U25.2
GND: C2.2 C3.2 C4.1 C5.1 C6.2 C7.1 C8.1 C9.1 C10.1 C11.1 C12.1 C13.1 C14.1 C15.1 D1.2 H2.4 H8.8 H9.6 H13.4 H15.2 H16.4 hole1.1(GND) hole2.1(GND) hole3.1(GND) hole4.1(GND) LED1.1(-) LED2.1(-) P1.2 P2.2 P3.2 P4.3 P5.5 Q1.2(E) Q2.2(E) R4.1 R8.1 R29.1 U2.7(GND) U2.9(EP) U3.2(GND) U5.2 U5.4 U5.6 U5.8 U6.2 U6.4 U6.6 U6.8 U21.1 U21.2 U21.21 U21.23 U21.35 U21.37 U21.39 U22.1 U22.2 U22.21 U22.23 U22.28 U22.37 U22.39 U23.1 U23.2 U23.21 U23.23 U23.35 U23.37 U23.39 U24.1 U24.2 U24.21 U24.23 U24.28 U24.37 U24.39 U25.3 U26.2 U26.4 U26.6 U26.8 U29.1
VBAT: P2.1 U1.2
VIN: C2.1 C3.1 C4.2 C5.2 P1.1 P3.1 U1.3 U2.2(VIN)
EXT_CHIP_VREF+: U21.36 U23.36
EXT_PIN_VREF+: U22.20 U24.20
NRST: U22.35 U24.35
PA0: H15.3 U21.3 U23.3
PA1: H15.4 U21.5 U23.5
PA2/ROSC: U22.19 U24.19
PA7: H10.7 U22.32 U24.32
PA8: U21.7 U23.7
PA9: H2.2 U21.9 U23.9
PA10/U0TX: P4.5 U21.12 U23.12
PA11/U0RX: P4.4 U21.14 U23.14
PA12: U21.29 U23.29
PA13: H13.3 U21.30 U23.30
PA14: H13.2 U22.11 U24.11
PA15: U22.12 U24.12 U25.1
PA16: H10.5 U22.13 U24.13
PA17: H2.3 U22.14 U24.14
PA18/BSL: U22.36 U24.36
PA19/SWDIO: U21.19 U23.19 U29.3
PA20/SWCLK: U21.20 U23.20 U29.2
PA21/VREF-: U22.18 U24.18
PA22: U22.10 U24.10
PA24: H10.1 U22.6 U24.6
PA25: U22.5 U24.5
PA26: U22.4 U24.4
PA27: H8.6 U22.3 U24.3
PA28: U21.4 U23.4
PA29: U21.34 U23.34
PA30: U22.27 U24.27
PA31: U21.6 U23.6
PB0/SPI1_CS2: H10.2 U22.29 U24.29
PB1/SPI1_CS3: H10.3 U22.30 U24.30
PB2: U21.15 U23.15
PB3: U21.17 U23.17
PB4: U21.8 U23.8
PB5: U21.10 U23.10
PB6: U21.25 U23.25
PB7: U21.26 U23.26
PB8: H16.2 U21.27 U23.27
PB9: H16.3 U21.28 U23.28
PB10: U22.31 U24.31
PB11: H9.3 U22.33 U24.33
PB12: U21.16 U23.16
PB13: U21.18 U23.18
PB14: H10.4 U22.34 U24.34
PB15: P5.3 U21.11 U23.11
PB16: P5.4 U21.13 U23.13
PB17: H9.2 U22.15 U24.15
PB18: H9.1 U22.16 U24.16
PB19: H10.6 U22.17 U24.17
PB20: U22.9 U24.9
PB21: H9.4 U22.25 U24.25
PB22: R7.2 R8.2 R29.2 R32.2 U22.26 U24.26
PB23: H8.2 U21.31 U23.31
PB24: U22.8 U24.8
PB25: U22.7 U24.7
PB26: H8.3 U21.32 U23.32
PB27: H8.4 U21.33 U23.33
$1N1042: C1.1 U2.1(BOOT)
$1N1058: C1.2 D1.1 L1.1 U2.8(PH)
$1N1158: C13.2 U2.4(SS)
$1N1897: R1.1 R4.2 U2.5(VSENSE)
$1N2016: C15.2 R5.1
$1N2020: C14.2 R5.2 U2.6(COMP)
$1N2296: LED1.2(+) R2.1
$1N2398: LED2.2(+) R3.1
$1N16322: SW3.5 U26.7
$1N16401: SW3.8 U26.1
$1N17521: SW3.6 U26.5
$1N17525: SW3.7 U26.3
$2N2960: BUZZER2.1(+) R6.2
$2N2963: Q1.1(B) R7.1
$2N8954: BUZZER2.2(-) Q1.3(C)
$2N9572: LED5.2 Q2.3(C)
$2N9593: LED5.1 R31.2
$2N9836: Q2.1(B) R32.1

Not connected (* = marked no-connect by the designer): H8 1* 5*; H9 5*; LED5 3*; P4 1* 6*; P5 1* 6*; U1 1*; U2 3(EN)*; U3 4(NC)*; U29 5*

## Notes on the sheets
sheet 3
- U1RX
- U1TX
- U3RX
- U3TX
- U0TX
- I2C0-SDA
- U2TX
- U0RX
- I2C0-SCL
- U2RX
- Trig
- Echo
- U0TX
- I2C0-SDA
- I2C0-SDA
- U0TX
- A0_0
- U0RX
- I2C0-SCL
- I2C0-SCL
- U0RX
- A0_2
- A0_4
- A0_1
- A0_3
- U1RX
- U1TX
- U1RX
- U1TX
- A0_6
- A0_5
- U2TX
- A0_12
- A0_7
- U2RX
- A1_1
- A1_0
- U3TX
- U3TX
- A1_4
- A1_2
- U3RX
- U3RX
- A1_6
- A1_5
- A1_7
- PA23
- U0TX
- I2C0-SDA
- I2C0-SDA
- U0TX
- A0_0
- U0RX
- I2C0-SCL
- I2C0-SCL
- U0RX
- A0_2
- A0_1
- A1_0
- U0RX
- U1TX
- U1TX
- A0_4
- A0_6
- A0_3
- A0_5
- U0TX
- U1RX
- U2TX
- U1RX
- A0_12
- A0_7
- U2RX
- A1_1
- A1_0
- U3TX
- U3TX
- A1_4
- A1_2
- U3RX
- U3RX
- A1_6
- A1_5
- A1_7
- PA23
- A0_0

# Board PCB1_1
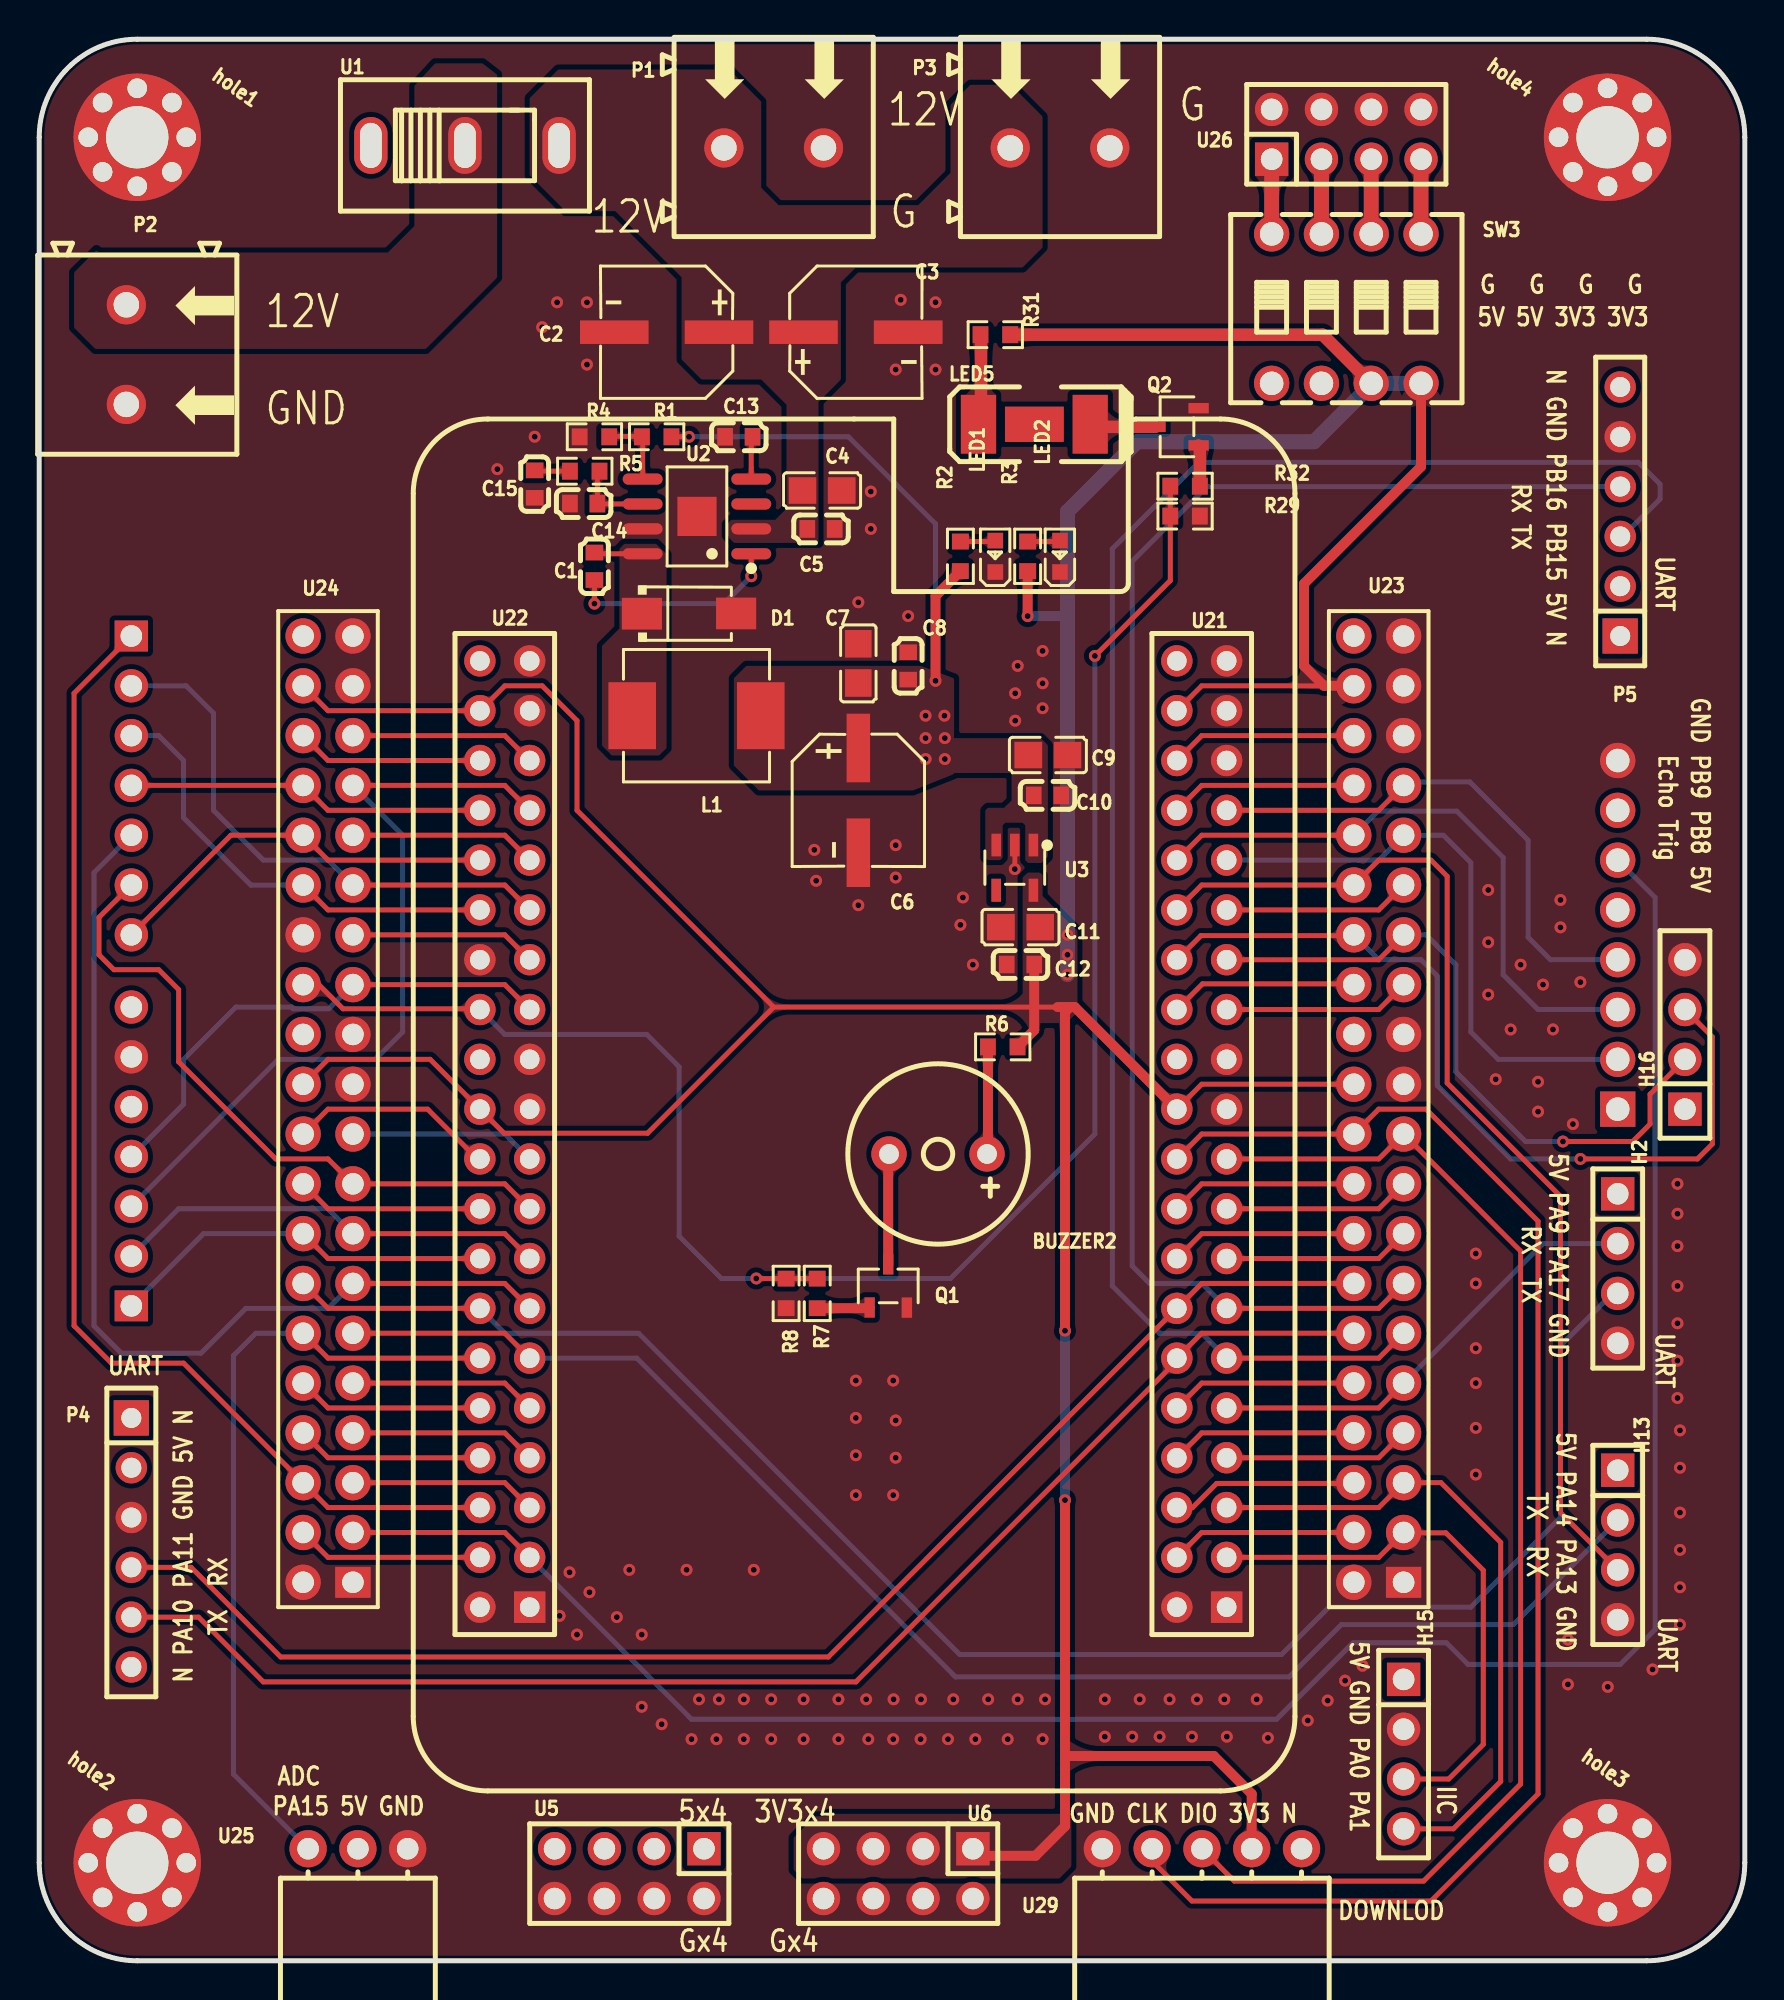
[diagram p3: board, top side]
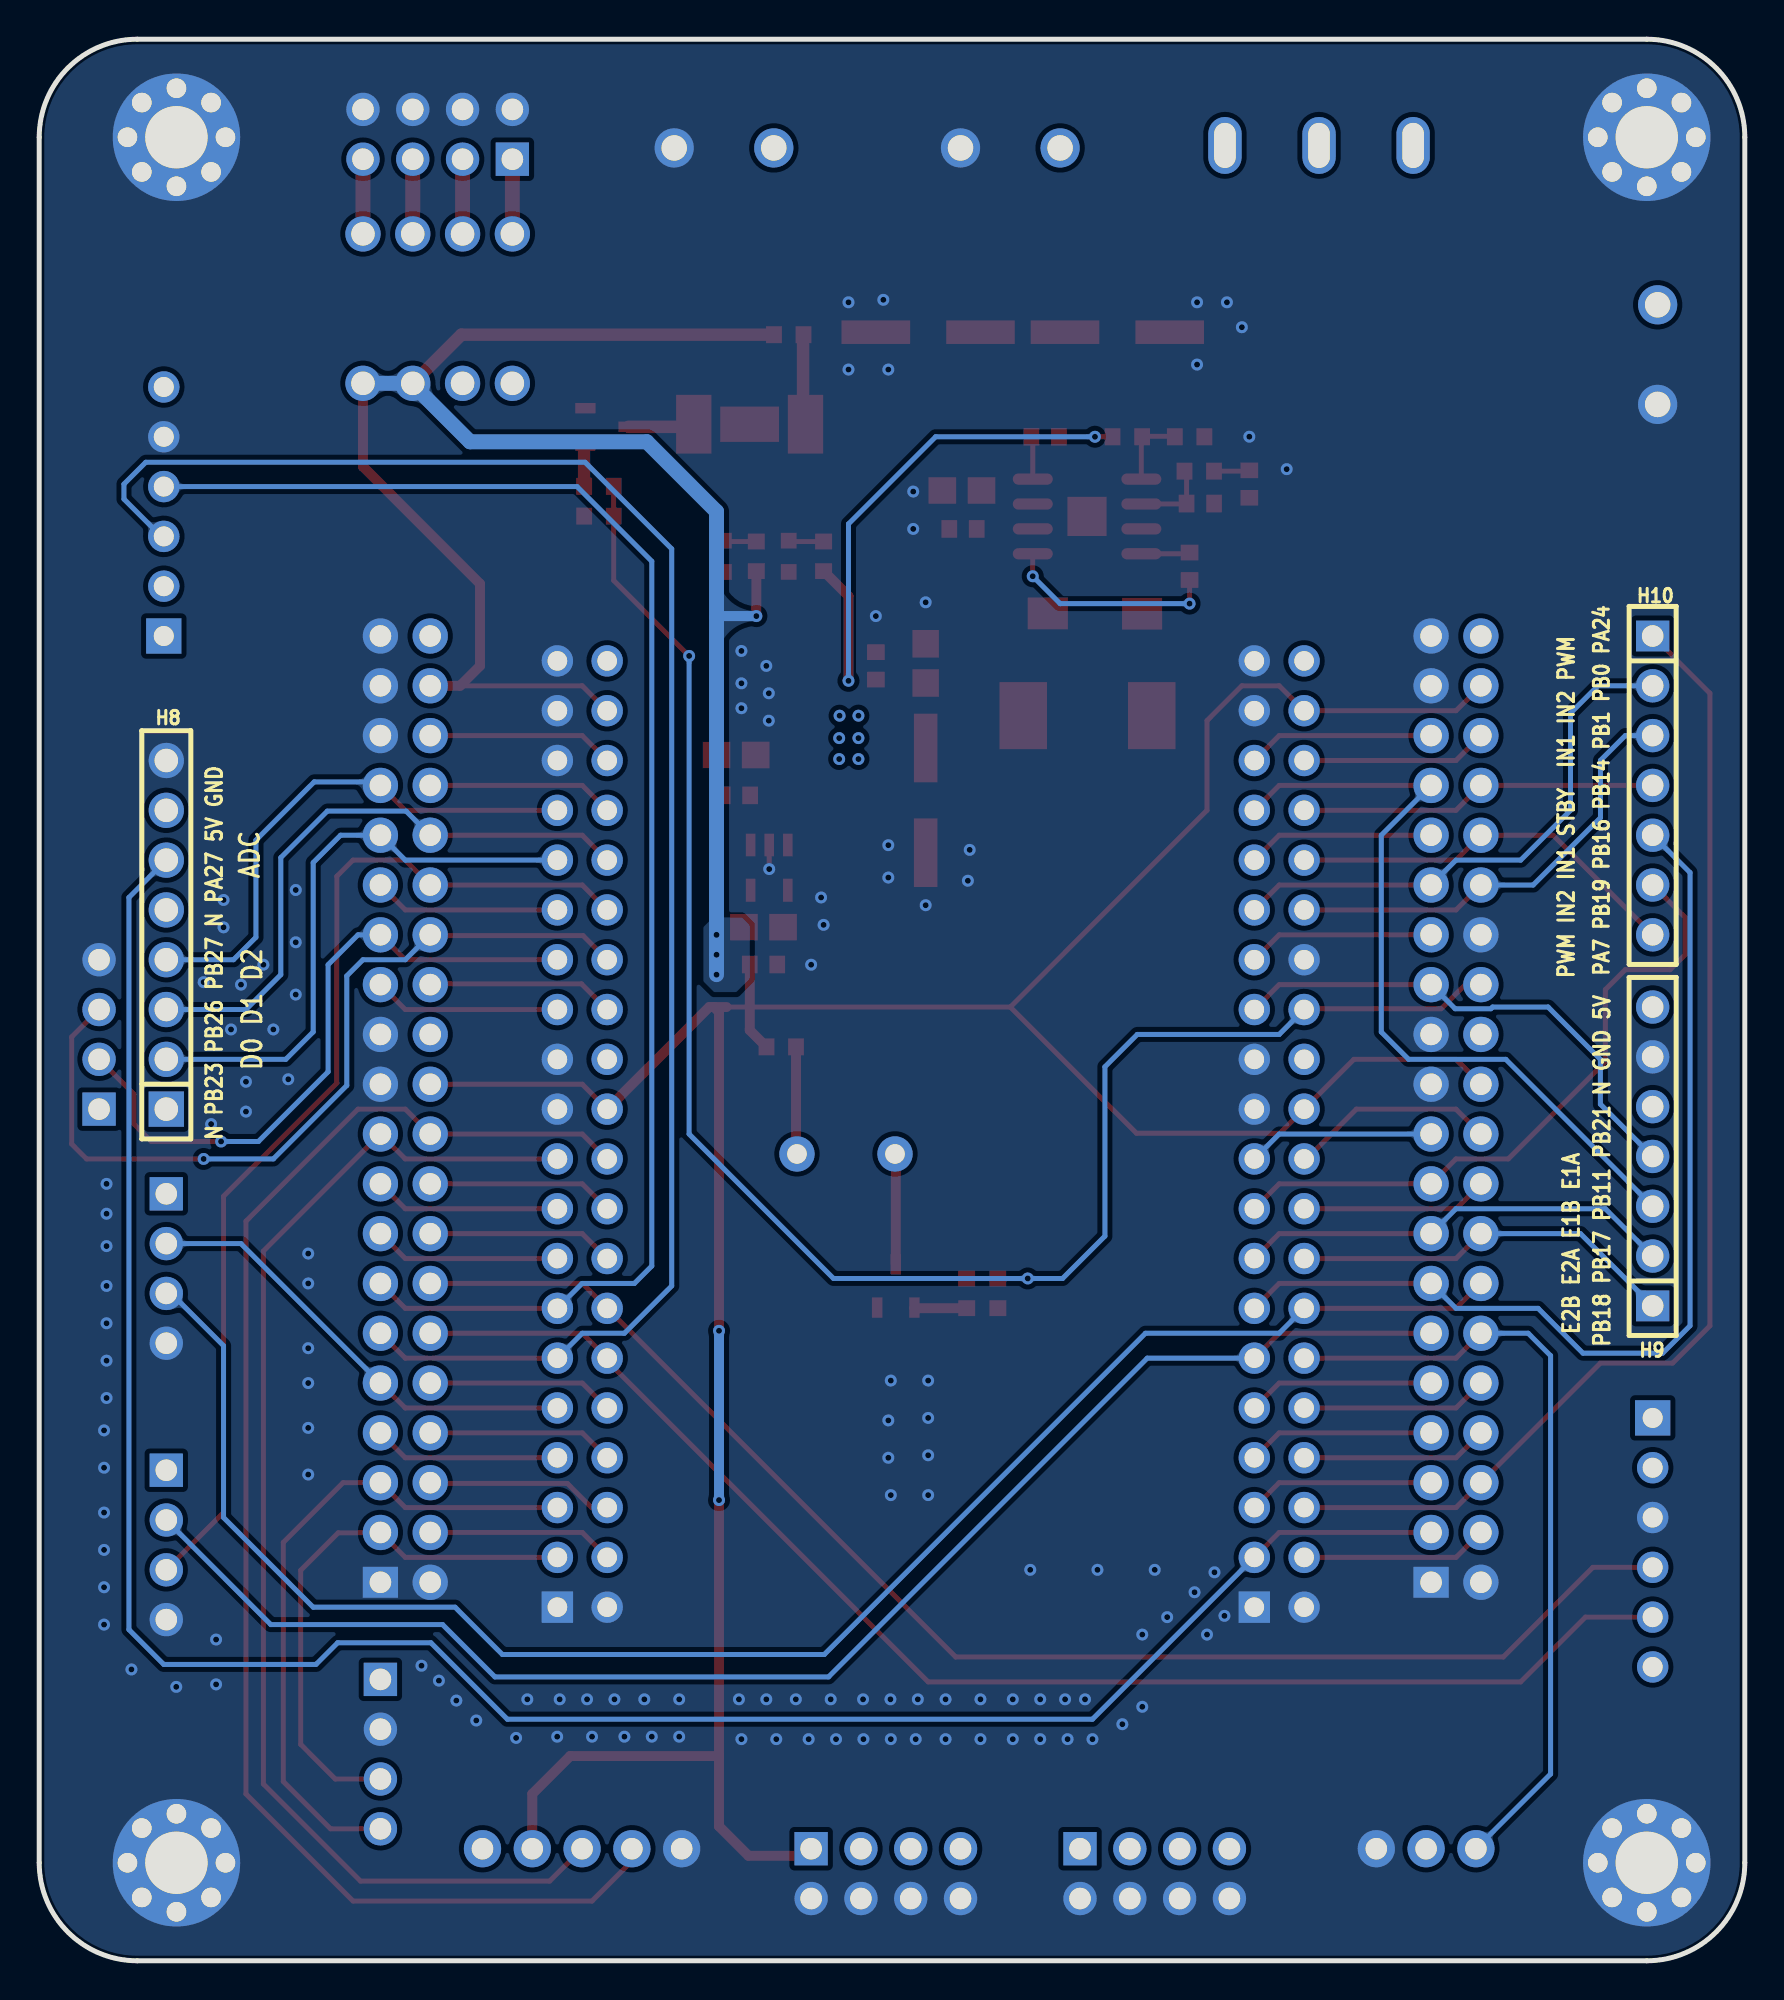
[diagram p4: board, bottom side, seen from below]

Outline 87 x 98 mm; copper layers: Top Layer, Inner1, Inner2, Bottom Layer. Coordinates in mm from the lower left corner of the outline.
Outline path: 0,93 0,5 arc(1.46,1.46) 5,0 82,0 arc(85.54,1.46) 87,5 87,93 arc(85.54,96.54) 82,98 5,98 arc(1.46,96.54) 0,93
Stack: Top Layer 0.035mm 外层铜厚1oz / Dielectric1 0.2104mm 7628 RC49% 8.6mil / Inner1 0.0152mm 内层铜厚 / Dielectric2 1.065mm 1.1mm H/HOZ Copper / Inner2 0.0152mm 内层铜厚 / Dielectric3 0.2104mm 7628 RC49% 8.6mil / Bottom Layer 0.035mm 外层铜厚1oz

## Design rules (mm)
template: 自定义配置
spacing copperThickness1oz (default): track to track 0.203, other pairs 0.203 to 0.254
spacing copperThickness2oz: track to track 0.203, other pairs 0.152 to 0.3
track width copperThickness1oz (default): min 0.127, default 0.254, max 2.54
track width copperThickness2oz: min 0.203, default 0.254, max 2.54
differential pair differentialPair (default): width min 0.127, default 0.254, max 2.54; gap min 0.152, default 0.152
via viaSize (default): diameter min 0.5, default 0.61, max 10; hole min 0.3, default 0.305, max 6.299

## Placement (name value [footprint] x y rotation side)
BUZZER2  3kHz  [BUZ-TH_BD9.0-P5.00-D0.6-FD]  45.85 41.15 180 top
C1  100nF  [C0603]  28.32 71.12 90 top
C2  220uF  [CAP-SMD_BD6.3-L6.6-W6.6-LS7.4-FD]  32 83.06 180 top
C3  220uF  [CAP-SMD_BD6.3-L6.6-W6.6-LS7.4-FD]  41.66 83.06 0 top
C4  10uF  [C0805]  39.93 74.99 180 top
C5  100nF  [C0603]  39.88 73.03 180 top
C6  100uF  [CAP-SMD_BD6.3-L6.6-W6.6-LS7.6-RD]  41.78 59.18 270 top
C7  10uF  [C0805]  41.78 66.17 270 top
C8  100nF  [C0603]  44.32 66.04 270 top
C9  10uF  [C0805]  51.45 61.49 180 top
C10  100nF  [C0603]  51.44 59.44 180 top
C11  10uF  [C0805]  50.06 52.72 0 top
C12  100nF  [C0603]  50.06 50.81 0 top
C13  10nF  [C0603]  35.69 77.72 0 top
C14  10pF  [C0603]  27.77 74.32 0 top
C15  1nF  [C0603]  25.27 75.31 90 top
D1  SS54  [SMA_L4.3-W2.6-LS5.0-RD]  33.15 68.71 0 top
H2  PZ254V-11-04P  [HDR-TH_4P-P2.54-V-M]  80.52 35.31 270 top
H8  2.54-1*8P母环保  [HDR-TH_8P-P2.54-V-F-1]  80.52 52.32 90 bottom
H9  PM254V-11-07-H85  [HDR-TH_7P-P2.54-V-F]  4.7 41.02 90 bottom
H10  PM254V-11-07-H85  [HDR-TH_7P-P2.54-V-F]  4.7 59.94 270 bottom
H13  PZ254V-11-04P  [HDR-TH_4P-P2.54-V-M]  80.52 21.21 270 top
H15  2.54-1*4P母  [HDR-TH_4P-P2.54-V-F]  69.6 10.54 270 top
H16  2.54-1*4P母  [HDR-TH_4P-P2.54-V-F]  83.95 47.24 90 top
hole1  M3  [m3 125x300]  5 93 0 top
hole2  M3  [m3 125x300]  5 5 0 top
hole3  M3  [m3 125x300]  80 5 0 top
hole4  M3  [m3 125x300]  80 93 0 top
L1  10uH  [IND-SMD_L7.3-W6.6]  33.53 63.5 180 top
LED1  LTST-C190KSKT  [LED0603-RD]  48.77 71.63 90 top
LED2  LTST-C190KSKT  [LED0603-RD]  52.07 71.63 90 top
LED5  XL-5730SURC-05  [LED-SMD_XL-5730SURC-05]  50.76 78.36 0 top
P1  WJ500V-5.08-2P  [CONN-TH_2P-P5.00_WJ500V-5.08-2P]  37.47 92.46 0 top
P2  WJ500V-5.08-2P  [CONN-TH_2P-P5.00_WJ500V-5.08-2P]  4.44 81.92 270 top
P3  WJ500V-5.08-2P  [CONN-TH_2P-P5.00_WJ500V-5.08-2P]  52.07 92.46 0 top
P4  2.54-1*6P母  [HDR-TH_6P-P2.54-V-F]  4.7 21.34 270 top
P5  2.54-1*6P母  [HDR-TH_6P-P2.54-V-F]  80.65 73.91 90 top
Q1  S8050 J3Y(RANGE:200-350)  [SOT-23-3_L3.0-W1.7-P0.95-LS2.9-BR]  43.31 34.42 270 top
Q2  S8050 J3Y(RANGE:200-350)  [SOT-23-3_L3.0-W1.7-P0.95-LS2.9-BR]  58.04 78.23 0 top
R1  100kΩ  [R0603]  31.5 77.72 0 top
R2  2kΩ  [R0603]  46.99 71.63 270 top
R3  1kΩ  [R0603]  50.42 71.63 270 top
R4  19.1kΩ  [R0603]  28.32 77.72 0 top
R5  29.4kΩ  [R0603]  27.83 75.97 0 top
R6  10Ω  [R0603]  49.15 46.61 180 top
R7  4.7kΩ  [R0603]  39.69 34.04 90 top
R8  10kΩ  [R0603]  38.1 34.04 90 top
R29  10kΩ  [R0603]  58.45 73.68 180 top
R31  10Ω  [R0603]  48.77 82.93 180 top
R32  10kΩ  [R0603]  58.45 75.2 180 top
SW3  DSWB04LHGET  [SW-TH_DSWB04LHGET]  66.68 84.26 180 top
U1  SS12D10G5  [SW-TH_SHOU-HAN_SS12D10G4]  21.72 92.58 0 top
U2  TPS54531DDAR  [SOIC-8_L5.0-W4.0-P1.27-LS6.0-BL-EP2.0]  33.55 73.66 90 top
U3  RT9013-33GB  [SOT-23-5_L3.0-W1.7-P0.95-LS2.8-BL]  49.76 55.75 180 top
U5  FG-PZ2.54-02-04P  [HDR-TH_8P-P2.54-V-M-R2-C4-S2.54]  30.1 4.44 180 top
U6  FG-PZ2.54-02-04P  [HDR-TH_8P-P2.54-V-M-R2-C4-S2.54]  43.81 4.44 180 top
U21  2.54-2*20  [HDR-TH_40P-P2.54-V-F-R2-C20-S2.54]  59.3 42.16 90 top
U22  2.54-2*20  [HDR-TH_40P-P2.54-V-F-R2-C20-S2.54]  23.75 42.16 90 top
U23  PZ2.54-2*20  [HDR-TH_40P-P2.54-V-M-R2-C20-S2.54]  68.33 43.43 90 top
U24  PZ2.54-2*20  [HDR-TH_40P-P2.54-V-M-R2-C20-S2.54]  14.73 43.43 90 top
U25  PM254-1-03-W-8.5  [HDR-TH_3P-P2.54-H-F-W10.0-N]  16.26 5.72 0 top
U26  FG-PZ2.54-02-04P  [HDR-TH_8P-P2.54-V-M-R2-C4-S2.54]  66.68 93.15 0 top
U29  PM254-1-05-W-8.5  [HDR-TH_5P-P2.54-H-F-W10.0-N]  59.31 5.72 0 top

## Footprints (pads in the part's own frame, mm; a bottom-side part is the same pattern mirrored in y, then rotated)
BUZ-TH_BD9.0-P5.00-D0.6-FD
  round 1.8 hole 1: 1(-2.5,0) 2(2.5,0)
C0603
  rect 0.8x0.9 smd: 1(-0.7,0) 2(0.7,0)
C0805
  rect 1.41x1.35 smd: 1(-1,0) 2(1,0)
CAP-SMD_BD6.3-L6.6-W6.6-LS7.4-FD
  rect 3.5x1.2 smd: 1(-2.67,0) 2(2.67,0)
CAP-SMD_BD6.3-L6.6-W6.6-LS7.6-RD
  rect 3.5x1.2 smd: 1(-2.67,0) 2(2.67,0)
CONN-TH_2P-P5.00_WJ500V-5.08-2P
  round 2 hole 1.3: 1(-2.54,0) 2(2.54,0)
HDR-TH_3P-P2.54-H-F-W10.0-N
  round 1.9 hole 1.1: 1(-2.54,0) 2(0,0) 3(2.54,0)
HDR-TH_4P-P2.54-V-F
  rect 1.7x1.7 hole 1.1: 1(-3.81,0)
  round 1.7 hole 1.1: 2(-1.27,0) 3(1.27,0) 4(3.81,0)
HDR-TH_4P-P2.54-V-M
  rect 1.7x1.7 hole 1.1: 1(-3.81,0)
  round 1.7 hole 1.1: 2(-1.27,0) 3(1.27,0) 4(3.81,0)
HDR-TH_5P-P2.54-H-F-W10.0-N
  round 1.9 hole 1.1: 1(-5.08,0) 2(-2.54,0) 3(0,0) 4(2.54,0) 5(5.08,0)
HDR-TH_6P-P2.54-V-F
  rect 1.8x1.8 hole 1.02: 1(-6.35,0)
  round 1.6 hole 1.02: 2(-3.81,0) 3(-1.27,0) 4(1.27,0) 5(3.81,0) 6(6.35,0)
HDR-TH_7P-P2.54-V-F
  rect 1.575x1.7 hole 1.1: 1(-7.62,0)
  round 1.7 hole 1.1: 2(-5.08,0) 3(-2.54,0) 4(0,0) 5(2.54,0) 6(5.08,0) 7(7.62,0)
HDR-TH_8P-P2.54-V-F-1
  rect 1.8x1.8 hole 1.2: 1(-8.89,0)
  round 1.8 hole 1.2: 2(-6.35,0) 3(-3.81,0) 4(-1.27,0) 5(1.27,0) 6(3.81,0) 7(6.35,0) 8(8.89,0)
HDR-TH_8P-P2.54-V-M-R2-C4-S2.54
  rect 1.7x1.7 hole 1.1: 1(-3.81,-1.27)
  round 1.7 hole 1.1: 2(-3.81,1.27) 3(-1.27,-1.27) 4(-1.27,1.27) 5(1.27,-1.27) 6(1.27,1.27) 7(3.81,-1.27) 8(3.81,1.27)
HDR-TH_40P-P2.54-V-F-R2-C20-S2.54
  rect 1.6x1.6 hole 1: 1(-24.13,-1.27)
  round 1.6 hole 1: 2(-24.13,1.27) 3(-21.59,-1.27) 4(-21.59,1.27) 5(-19.05,-1.27) 6(-19.05,1.27) 7(-16.51,-1.27) 8(-16.51,1.27) 9(-13.97,-1.27) 10(-13.97,1.27) 11(-11.43,-1.27) 12(-11.43,1.27) 13(-8.89,-1.27) 14(-8.89,1.27) 15(-6.35,-1.27) 16(-6.35,1.27) 17(-3.81,-1.27) 18(-3.81,1.27) 19(-1.27,-1.27) 20(-1.27,1.27) 21(1.27,-1.27) 22(1.27,1.27) 23(3.81,-1.27) 24(3.81,1.27) 25(6.35,-1.27) 26(6.35,1.27) 27(8.89,-1.27) 28(8.89,1.27) 29(11.43,-1.27) 30(11.43,1.27) 31(13.97,-1.27) 32(13.97,1.27) 33(16.51,-1.27) 34(16.51,1.27) 35(19.05,-1.27) 36(19.05,1.27) 37(21.59,-1.27) 38(21.59,1.27) 39(24.13,-1.27) 40(24.13,1.27)
HDR-TH_40P-P2.54-V-M-R2-C20-S2.54
  rect 1.575x1.8 hole 1.1: 1(-24.13,-1.27)
  round 1.8 hole 1.1: 2(-24.13,1.27) 3(-21.59,-1.27) 4(-21.59,1.27) 5(-19.05,-1.27) 6(-19.05,1.27) 7(-16.51,-1.27) 8(-16.51,1.27) 9(-13.97,-1.27) 10(-13.97,1.27) 11(-11.43,-1.27) 12(-11.43,1.27) 13(-8.89,-1.27) 14(-8.89,1.27) 15(-6.35,-1.27) 16(-6.35,1.27) 17(-3.81,-1.27) 18(-3.81,1.27) 19(-1.27,-1.27) 20(-1.27,1.27) 21(1.27,-1.27) 22(1.27,1.27) 23(3.81,-1.27) 24(3.81,1.27) 25(6.35,-1.27) 26(6.35,1.27) 27(8.89,-1.27) 28(8.89,1.27) 29(11.43,-1.27) 30(11.43,1.27) 31(13.97,-1.27) 32(13.97,1.27) 33(16.51,-1.27) 34(16.51,1.27) 35(19.05,-1.27) 36(19.05,1.27) 37(21.59,-1.27) 38(21.59,1.27) 39(24.13,-1.27) 40(24.13,1.27)
IND-SMD_L7.3-W6.6
  rect 2.424x3.42 smd: 1(3.278,0) 2(-3.278,0)
LED0603-RD
  rect 0.8x0.8 smd: 1(-0.799,0) 2(0.799,0)
LED-SMD_XL-5730SURC-05
  rect 1.8x3 smd: 1(-2.849,0) 2(2.849,0)
  rect 3x1.8 smd: 3(0,0)
m3 125x300
  round 1 hole 1: 1(-2.5,0) 1(-1.768,1.768) 1(-1.768,-1.768) 1(0,2.5) 1(0,-2.5) 1(1.768,1.768) 1(2.5,0)
  round 6.5 hole 3.18x3.175: 1(0,0)
  round 1 hole 1.021x1: 1(1.768,-1.768)
R0603
  rect 0.806x0.864 smd: 1(-0.753,0) 2(0.753,0)
SMA_L4.3-W2.6-LS5.0-RD
  rect 2.046x1.62 smd: 1(-2.404,-0.009) 2(2.404,0.009)
SOIC-8_L5.0-W4.0-P1.27-LS6.0-BL-EP2.0
  oval 0.574x2.038 smd: 1(-1.905,-2.769) 2(-0.635,-2.769) 3(0.635,-2.769) 4(1.905,-2.769) 5(1.905,2.769) 6(0.635,2.769) 7(-0.635,2.769) 8(-1.905,2.769)
  rect 2x2 smd: 9(0,0)
SOT-23-3_L3.0-W1.7-P0.95-LS2.9-BR
  rect 1.038x0.532 smd: 1(1.101,-0.95) 2(1.101,0.95) 3(-1.101,0)
SOT-23-5_L3.0-W1.7-P0.95-LS2.8-BL
  rect 0.49x1.157 smd: 1(-0.95,-1.153) 2(0,-1.153) 3(0.95,-1.153)
  rect 0.49x1.175 smd: 4(0.95,1.153) 5(-0.95,1.153)
SW-TH_DSWB04LHGET
  round 1.8 hole 1.2: 1(-3.81,3.81) 2(-1.27,3.81) 3(1.27,3.81) 4(3.81,3.81) 5(-3.81,-3.81) 6(-1.27,-3.81) 7(1.27,-3.81) 8(3.81,-3.81)
SW-TH_SHOU-HAN_SS12D10G4
  oval 1.7x2.9 hole 1.1x2.3: 1(-4.8,0) 2(0,0) 3(4.8,0)

## Nets
As in the schematic.

Pads without a net: H8 1 5; H9 5; LED5 3; P4 1 6; P5 1 6; U1 1; U2 3; U3 4; U29 5

## Via types
v1: diameter 0.61, hole 0.305, Top Layer to Bottom Layer, 147 vias

## Routing (per net, layer and track width the routed paths; a pad name or vN(x,y) marks a point on that pad's centre or on a via; arc(x,y) is an arc through that point)
3V3: length 256.6
  Top Layer w0.254: 37.47,48.64 31.03,42.2 23.71,42.2 U22.22 19.94,45.97 14.73,45.97 U24.22 ; 37.47,48.64 27.43,58.67 27.43,63.25 25.65,65.02 23.75,65.02 U22.38 14.73,63.75 U24.38 ; 37.47,48.64 51.94,48.64 ; U23.22 59.3,44.7 U21.22 ; U21.38 59.3,65.02 65.53,65.02
  Top Layer w0.508: C12.2 50.76,47.46 R6.1 ; SW3.1 70.49,76.2 64.52,70.23 64.52,66.04 65.53,65.02 U23.38 ; 52.32,10.44 52.32,6.86 50.82,5.36 47.98,5.36 U6.1 ; 52.32,10.44 59.91,10.44 61.85,8.51 U29.4 ; 52.32,10.44 v1(52.32,23.5) ; R3.2 v1(50.42,68.58) ; U21.22 52.82,48.64 52.58,48.64 ; 51.94,48.64 52.58,48.64 ; 52.58,48.64 52.32,48.39 v1(52.32,32.13)
  Top Layer w0.635: 67.94,80.45 65.46,82.93 R31.1
  Bottom Layer w0.508: 52.45,68.54 52.41,68.58 v1(50.42,68.58) ; v1(52.32,23.5) v1(52.32,32.13)
  Bottom Layer w0.762: SW3.1 67.94,80.45 67.94,80.39 65.02,77.47 56.01,77.47 52.45,73.91 v1(52.45,52.32) v1(52.45,51.31) v1(52.45,50.29)
+5V: length 29.4
  Top Layer w0.254: R1.2 v1(33.15,77.72)
  Top Layer w0.508: v1(45.72,65.28) 45.72,69.6 R2.2
  Bottom Layer w0.254: v1(45.72,65.28) 45.72,73.28 41.28,77.72 v1(33.15,77.72)
  vias: v1(45.21,63.5) v1(45.21,62.36) v1(45.21,61.29) v1(46.17,63.5) v1(46.19,62.36) v1(46.19,61.29)
GND: length 1.6
  Top Layer w0.254: v1(49.76,55.68) 49.76,57.29
  vias: v1(23.37,76.07) v1(25.27,77.73) v1(25.65,83.31) v1(26.42,84.58) v1(26.54,17.59) v1(27.05,19.81) v1(27.43,16.64) v1(27.94,84.58) v1(27.94,81.41) v1(28.07,18.8) v1(29.46,17.53) v1(30.1,19.94) v1(30.73,16.64) v1(30.73,12.95) v1(31.75,12.06) v1(33.02,19.94) v1(33.27,11.3) v1(33.66,13.34) v1(34.54,11.3) v1(34.67,13.34) v1(35.94,13.34) v1(35.94,11.3) v1(36.45,19.94) v1(37.34,13.34) v1(37.34,11.3) v1(38.99,13.34) v1(38.99,11.3) v1(39.54,56.66) v1(39.63,55.08) v1(40.77,13.34) v1(40.77,11.3) v1(41.66,29.59) v1(41.66,27.69) v1(41.66,25.78) v1(41.66,23.75) v1(41.78,69.28) v1(41.78,53.83) v1(42.18,13.34) v1(42.29,11.3) v1(42.42,74.93) v1(42.42,73.03) v1(43.56,29.59) v1(43.56,23.75) v1(43.58,13.34) v1(43.56,11.3) v1(43.69,81.15) v1(43.69,56.9) v1(43.69,55.25) v1(43.69,27.56) v1(43.69,25.65) v1(43.94,84.71) v1(44.32,68.58) v1(44.98,13.34) v1(44.96,11.3) v1(45.72,84.58) v1(45.72,81.15) v1(46.35,11.3) v1(46.63,13.34) v1(46.99,52.83) v1(47.12,54.23) v1(47.62,50.8) v1(47.75,11.3) v1(48.41,13.34) v1(49.4,11.3) v1(49.78,64.64) v1(49.78,63.25) v1(49.91,66.04) v1(49.91,13.34) v1(51.18,66.8) v1(51.18,65.15) v1(51.18,63.88) v1(51.18,11.3) v1(51.31,13.34) v1(54.36,13.34) v1(54.36,11.43) v1(55.75,11.43) v1(56.13,13.34) v1(57.15,11.43) v1(57.66,13.34) v1(58.8,11.43) v1(59.06,13.34) v1(60.45,13.34) v1(60.58,11.43) v1(62.1,13.34) v1(62.67,11.37) v1(64.71,12.26) v1(65.72,13.27) v1(66.61,14.29) v1(67.5,15.05) v1(73.28,36.07) v1(73.28,34.54) v1(73.28,31.24) v1(73.28,29.46) v1(73.28,27.18) v1(73.28,24.8) v1(73.91,54.61) v1(73.91,51.94) v1(73.91,49.28) v1(74.29,44.96) v1(75.06,47.5) v1(75.56,50.8) v1(76.45,44.83) v1(76.45,43.31) v1(76.71,49.78) v1(77.22,47.5) v1(77.6,54.1) v1(77.6,52.7) v1(77.98,16.38) v1(77.98,14.1) v1(78.23,42.67) v1(78.61,49.91) v1(80.01,13.97) v1(82.3,14.86) v1(83.57,39.62) v1(83.57,38.1) v1(83.57,36.45) v1(83.57,34.42) v1(83.57,32.51) v1(83.57,30.61) v1(83.57,28.7) v1(83.69,27.05) v1(83.69,25.15) v1(83.69,22.86) v1(83.69,20.96) v1(83.69,19.05) v1(83.69,17.15)
EXT_CHIP_VREF+: length 9.6
  Top Layer w0.254: U23.36 59.3,62.48 U21.36
EXT_PIN_VREF+: length 10.6
  Top Layer w0.254: U24.20 14.73,43.43 19.81,43.43 22.35,40.89 U22.20
NRST: length 9.5
  Top Layer w0.254: U24.35 23.75,62.48 25.02,61.21
PA0: length 28.2
  Top Layer w0.254: 69.59,9.27 69.59,9.15 69.6,9.14 ; H15.3 71.9,9.27 73.66,11.04 73.66,19.92 71.75,21.83 69.61,21.83 U23.3 68.33,20.57 60.57,20.57
PA1: length 33.9
  Top Layer w0.254: H15.4 72.14,6.73 74.55,9.14 74.55,21.34 71.5,24.38 U23.5 68.33,23.11 60.57,23.11
PA2/ROSC: length 9.5
  Bottom Layer w0.254: U24.19 23.75,42.16 25.02,40.89
PA7: length 20.4
  Top Layer w0.254: H10.7 9.78,57.4 U24.32 14.73,56.13 U22.32
PA8: length 9.6
  Top Layer w0.254: U23.7 68.33,25.65 60.57,25.65
PA9: length 23.4
  Top Layer w0.254: U23.9 68.33,28.19 60.57,28.19
  Bottom Layer w0.254: U23.9 76.71,36.58 H2.2
PA10/U0TX: length 71.2
  Top Layer w0.254: P4.5 8.13,17.53 11.43,14.22 41.66,14.22 58.03,30.6 U21.12 59.3,32 U23.12
PA11/U0RX: length 72.1
  Top Layer w0.254: U23.14 59.3,34.54 U21.14 40.25,15.49 12.32,15.49 7.75,20.07 P4.4
PA12: length 9.6
  Top Layer w0.254: 60.57,53.59 68.33,53.59 U23.29
PA13: length 54.2
  Top Layer w0.254: H13.3 77.6,22.86 77.6,38.99 71.82,44.77 71.82,55.31 70.99,56.13 68.33,56.13 U23.30 59.3,54.86 U21.30
PA14: length 75.1
  Top Layer w0.254: U24.11 23.75,32 25.02,30.73
  Bottom Layer w0.254: 25.02,30.73 30.48,30.73 46.74,14.48 63.75,14.48 66.42,17.15 75.18,17.15 H13.2
PA15: length 40.3
  Top Layer w0.254: U24.12 14.73,30.73 U22.12
  Bottom Layer w0.254: U25.1 9.91,9.53 9.91,30.86 11.05,32 U24.12
PA16: length 50.6
  Top Layer w0.254: 25.02,33.27 23.75,34.54 U24.13
  Bottom Layer w0.254: H10.5 2.79,55.5 2.79,32.39 4.19,30.99 8.25,30.99 10.54,33.27 14.73,33.27 U24.13
PA17: length 87.7
  Top Layer w0.254: U24.14 14.73,33.27 U22.14
  Bottom Layer w0.254: H2.3 80.26,34.04 77.6,31.37 77.6,22.61 73.03,18.03 65.79,18.03 63.37,15.62 46.95,15.62 30.57,32 23.75,32 U22.14
PA18/BSL: length 9.5
  Top Layer w0.254: U24.36 14.73,61.21 U22.36
PA19/SWDIO: length 64.2
  Top Layer w0.254: U29.3 60.96,4.06 70.61,4.06 75.56,9.02 75.56,36.19 U23.19 68.33,40.89 60.57,40.89
PA20/SWCLK: length 74.5
  Top Layer w0.254: U29.2 56.77,5.08 58.8,3.05 70.99,3.05 76.45,8.51 76.45,37.72 70.74,43.43 68.33,43.43 U23.20 59.3,42.16 U21.20
PA21/VREF-: length 9.5
  Top Layer w0.254: U22.18 14.73,38.35 U24.18
PA22: length 9.5
  Top Layer w0.254: U22.10 14.73,28.19 U24.10
PA24: length 60.9
  Top Layer w0.254: U22.6 14.73,23.11 U24.6 7.37,30.48 3.68,30.48 1.78,32.39 1.78,64.64 H10.1
PA25: length 9.5
  Top Layer w0.254: U24.5 23.75,24.38 25.02,23.11
PA26: length 9.5
  Top Layer w0.254: U24.4 14.73,20.57 U22.4
PA27: length 113.2
  Top Layer w0.254: 25.02,20.57 23.75,21.84 U24.3
  Bottom Layer w0.254: H8.6 82.42,54.23 82.42,16.89 80.65,15.11 72.88,15.11 71.78,16.22 67.02,16.22 63.12,12.32 33.27,12.32 25.02,20.57
PA28: length 9.6
  Top Layer w0.254: U21.4 59.3,21.84 U23.4
PA29: length 9.6
  Top Layer w0.254: U21.34 59.3,59.94 U23.34
PA30: length 9.5
  Top Layer w0.254: U24.27 23.75,52.32 25.02,51.05
PA31: length 9.6
  Top Layer w0.254: U21.6 58.83,23.11 60.06,24.34 67.02,24.34 U23.6
PB0/SPI1_CS2: length 28
  Top Layer w0.254: 25.02,53.59 23.75,54.86 U24.29
  Bottom Layer w0.254: H10.2 7.49,65.02 8.89,63.63 8.89,58.67 11.43,56.13 14.73,56.13 U24.29
PB1/SPI1_CS3: length 23.2
  Top Layer w0.254: U24.30 14.73,53.59 U22.30
  Bottom Layer w0.254: U24.30 10.8,54.86 7.36,58.3 7.36,61.22 6.1,62.48 H10.3
PB2: length 9.6
  Top Layer w0.254: U23.15 68.33,35.81 60.57,35.81
PB3: length 9.6
  Top Layer w0.254: U23.17 68.33,38.35 60.57,38.35
PB4: length 9.6
  Top Layer w0.254: U23.8 59.3,26.92 U21.8
PB5: length 9.6
  Top Layer w0.254: U23.10 59.3,29.46 U21.10
PB6: length 9.6
  Top Layer w0.254: U23.25 68.33,48.51 60.57,48.51
PB7: length 9.6
  Top Layer w0.254: U23.26 67.06,49.82 59.34,49.82 U21.26
PB8: length 34.1
  Top Layer w0.254: U23.27 68.33,51.05 60.57,51.05 ; v1(77.72,41.78) 81.28,41.78 82.17,42.67 82.17,44.2 H16.2
  Bottom Layer w0.254: U23.27 70.74,52.32 72.26,50.8 72.26,45.34 75.82,41.78 v1(77.72,41.78)
PB9: length 43.6
  Top Layer w0.254: U21.28 59.26,52.28 67.02,52.28 U23.28 ; v1(78.61,40.89) 84.58,40.89 85.34,41.66 85.34,47.12 H16.3
  Bottom Layer w0.254: v1(78.61,40.89) 75.06,40.89 71.31,44.64 71.31,50.23 70.49,51.05 68.33,51.05 U23.28
PB10: length 9.5
  Top Layer w0.254: 25.02,56.13 23.75,57.4 U24.31
PB11: length 40.7
  Top Layer w0.254: 25.02,58.67 23.75,59.94 U24.33
  Bottom Layer w0.254: U24.33 18.54,57.4 18.54,47.37 17.14,45.97 12.19,45.97 H9.3
PB12: length 9.6
  Top Layer w0.254: U21.16 59.3,37.08 U23.16
PB13: length 9.6
  Top Layer w0.254: U21.18 59.3,39.62 U23.18
PB14: length 18.3
  Top Layer w0.254: H10.4 U24.34 14.73,58.67 U22.34
PB15: length 88.3
  Top Layer w0.254: 60.57,30.73 68.33,30.73 U23.11
  Bottom Layer w0.254: P5.3 80.77,72.64 82.68,74.55 82.68,75.31 81.56,76.42 59.15,76.42 54.74,72.01 54.74,34.42 57.15,32 59.3,32 60.57,30.73
PB16: length 77.7
  Top Layer w0.254: 60.57,33.27 68.33,33.27 U23.13
  Bottom Layer w0.254: P5.4 59.56,75.18 55.75,71.37 55.75,35.43 56.64,34.54 59.31,34.54 60.57,33.28 60.57,33.27
PB17: length 22.4
  Top Layer w0.254: 25.02,35.81 23.75,37.08 U24.15
  Bottom Layer w0.254: H9.2 7.11,38.35 14.73,38.35 U24.15
PB18: length 19.8
  Top Layer w0.254: U24.16 14.73,35.81 U22.16
  Bottom Layer w0.254: U24.16 8.38,37.08 H9.1
PB19: length 33.7
  Top Layer w0.254: H10.6 3.05,53.21 3.05,51.31 3.81,50.55 6.1,50.55 7.11,49.53 7.11,45.85 12.06,40.89 14.73,40.89 U24.17 23.75,39.62 25.02,38.35
PB20: length 9.5
  Top Layer w0.254: 25.02,28.19 23.75,29.46 U24.9
PB21: length 25.9
  Top Layer w0.254: U24.25 23.75,49.78 25.02,48.51
  Bottom Layer w0.254: H9.4 7.37,43.69 7.37,45.97 10.03,48.64 12.86,48.64 12.95,48.55 14.77,48.55 U24.25
PB22: length 92.5
  Top Layer w0.254: v1(53.85,66.55) 57.7,70.4 R29.2 R32.2 ; v1(36.58,34.8) 36.58,34.79 R8.2 R7.2 ; U24.26 14.26,49.78 15.49,48.55 22.44,48.55 U22.26
  Bottom Layer w0.254: v1(53.85,66.55) 53.85,42.16 46.48,34.8 v1(36.58,34.8) 34.8,34.8 32.64,36.96 32.64,45.59 30.99,47.24 23.75,47.24 U22.26
PB23: length 30.3
  Bottom Layer w0.254: H8.2 74.42,45.97 73.03,47.37 73.03,56.01 71.63,57.4 U23.31 68.33,56.13 60.57,56.13
PB24: length 9.5
  Top Layer w0.254: U22.8 14.73,25.65 U24.8
PB25: length 9.5
  Top Layer w0.254: 25.02,25.65 23.75,26.92 U24.7
PB26: length 31.2
  Top Layer w0.254: U21.32 59.3,57.4 U23.32
  Bottom Layer w0.254: H8.3 76.45,48.51 74.68,50.29 74.68,56.26 72.3,58.63 68.29,58.63 U23.32
PB27: length 27.2
  Top Layer w0.254: 60.57,58.67 68.33,58.67 U23.33
  Bottom Layer w0.254: U23.33 69.78,60.12 72.97,60.12 75.95,57.15 75.95,52.2 77.09,51.05 H8.4
$1N1042: length 10.9
  Top Layer w0.254: C1.1 v1(28.32,69.22) ; U2.1 36.32,71.75 v1(36.32,70.61)
  Bottom Layer w0.254: v1(36.32,70.61) 34.93,69.22 v1(28.32,69.22)
$1N1058: length 2.5
  Top Layer w0.254: 28.32,71.69 28.38,71.76 U2.8
$1N1158: length 2.1
  Top Layer w0.254: U2.4 36.32,77.59 36.35,77.62
$1N1897: length 4
  Top Layer w0.254: U2.5 30.78,77.7 30.83,77.75 29.1,77.75 R4.2
$1N2016: length 1.8
  Top Layer w0.254: 27.2,75.97 25.42,75.97
$1N2020: length 4
  Top Layer w0.254: 30.78,74.3 28.49,74.3 C14.2 28.47,75.9 28.4,75.97
$1N2296: length 1.8
  Top Layer w0.254: LED1.2 48.72,72.38 R2.1
$1N2398: length 1.7
  Top Layer w0.254: LED2.2 52.02,72.38 R3.1
$1N16322: length 3.8
  Top Layer w0.762: U26.7 SW3.5
$1N16401: length 3.8
  Top Layer w0.762: U26.1 SW3.8
$1N17521: length 3.8
  Top Layer w0.762: 67.94,91.88 67.94,88.07
$1N17525: length 3.8
  Top Layer w0.762: SW3.7 U26.3
$2N2960: length 5.5
  Top Layer w0.508: BUZZER2.1 48.4,41.2 R6.2
$2N2963: length 2.7
  Top Layer w0.508: R7.1 42.36,33.28 Q1.1
$2N8954: length 5.6
  Top Layer w0.508: BUZZER2.2 43.31,41.11 Q1.3
$2N9572: length 3.4
  Top Layer w0.635: Q2.3 53.74,78.23 LED5.2
$2N9593: length 4.6
  Top Layer w0.635: LED5.1 48.04,78.49 48.04,82.91 R31.2
$2N9836: length 2.1
  Top Layer w0.635: R32.1 59.2,77.22 Q2.1

## Copper pours and planes (outline as drawn; the poured copper is in the pictures)
3V3 on Top Layer: 40.13,7.37 39.57,7.37 38.48,6.28 38.48,4.64 38.93,4.19 52.03,4.19 52.65,4.81 52.65,7.42 52.58,7.49 40.26,7.49
3V3 on Top Layer: 50.42,55.5 50.16,55.25 50.16,48.12 50.46,47.83 52.4,47.83 52.96,48.39 52.96,52.53 51.18,54.31 51.18,55.37 51.05,55.5
3V3 on Bottom Layer: 52.63,53.21 53.12,52.72 53.12,49.95 52.58,49.4 51.44,49.4 50.76,50.09 50.76,52.8 51.16,53.21
+5V on Top Layer: 44.96,66.04 46.67,65.41 46.67,60.53 44.58,59.69 36.7,59.69 35.43,60.96 35.43,65.41 36.07,66.04
+5V on Top Layer: 46.35,62.1 46.61,62.36 51.09,62.36 51.45,61.99 51.45,56.31 51.13,55.99 50.44,55.99 50.29,56.13 50.29,57.91 50.16,58.04 49.28,58.04 49.15,57.91 49.15,56.26 49.02,56.13 48.39,56.13 48.26,56.26 48.26,58.67 48.39,58.8 49.22,58.8 49.6,59.18 49.6,60.51 49.53,60.58 46.61,60.58 46.35,60.83
+5V on Inner1: 4.95,105.92 -5.59,95.38 -5.59,1.4 5.21,-9.4 81.41,-9.4 93.98,3.18 93.98,97.54 85.6,105.92
GND on Top Layer: 5.97,112.9 -7.87,99.06 -7.87,-0.38 4.06,-12.32 83.06,-12.32 98.81,3.43 98.81,97.54 83.44,112.9
GND on Bottom Layer: 14.73,115.32 -2.29,98.3 -12.19,98.3 -12.19,-2.16 -0.38,-13.97 82.55,-13.97 98.81,2.29 98.81,90.42 73.91,115.32
GND on Inner2: 9.14,105.03 -1.02,105.03 -1.52,104.52 -1.52,2.41 5.97,-5.08 84.2,-5.08 91.44,2.16 91.44,97.03 82.04,106.43 10.54,106.43
VBAT on Top Layer: 2.92,87.25 1.78,86.11 1.78,83.29 2.86,82.2 19.72,82.2 23.36,85.84 23.36,96.2 22.61,96.77 20.19,96.77 19.13,95.62 19.13,88.47 17.78,87.12 3.05,87.12
VIN on Top Layer: 25.02,95 25.02,91.06 26.84,89.23 29.38,89.23 32.77,85.85 32.77,81.66 33.78,80.64 36.83,80.64 38.12,79.36 38.12,74.06 37.55,73.49 35.3,73.49 35.07,73.26 35.07,72.68 35.44,72.32 39.75,72.32 39.75,79.5 40.89,80.64 40.89,85.6 41.66,86.36 50.16,86.36 51.18,87.38 51.18,94.06 49.56,95.67 47.5,95.67 46.48,94.66 46.48,91.19 44.83,89.53 37.72,89.53 36.83,90.42 36.83,94.82 35.19,96.46 26.48,96.46
$1N1058 on Top Layer: 29.84,72.26 29.59,72.01 29.59,67.94 28.7,67.06 28.7,61.98 29.21,61.47 31.62,61.47 32,61.85 32,71.73 31.47,72.26

Small or netless copper shapes (teardrops, artwork), in the pictures only: 222 on Top Layer, 57 on Bottom Layer

## Text on the board
Bottom Silkscreen Layer: PA7 PB19 PB16 PB14 PB1 PB0 PA24 | PB18 PB17 PB11 PB21 N GND 5V | PWM IN2 IN1 STBY  IN1 IN2 PWM | N PB23 PB26 PB27 N PA27 5V GND | E2B E2A E1B E1A | D0 D1 D2 | ADC
Top Silkscreen Layer: 5V 5V 3V3 3V3 | G   G   G   G | 5V GND PA0 PA1 | IIC | N GND PB16 PB15 5V N | 5V PA9 PA17 GND | 5V PA14 PA13 GND | UART | Echo Trig | GND PB9 PB8 5V | N PA10 PA11 GND 5V N | TX  RX | RX TX | RX  TX | PA15 5V GND | ADC | GND CLK DIO 3V3 N | DOWNLOD | 5x4  3V3x4 | Gx4   Gx4 | 12V | GND | G
